# Altium project iMX6 Rex_V1I1.PrjPcb (part 1 of 2)
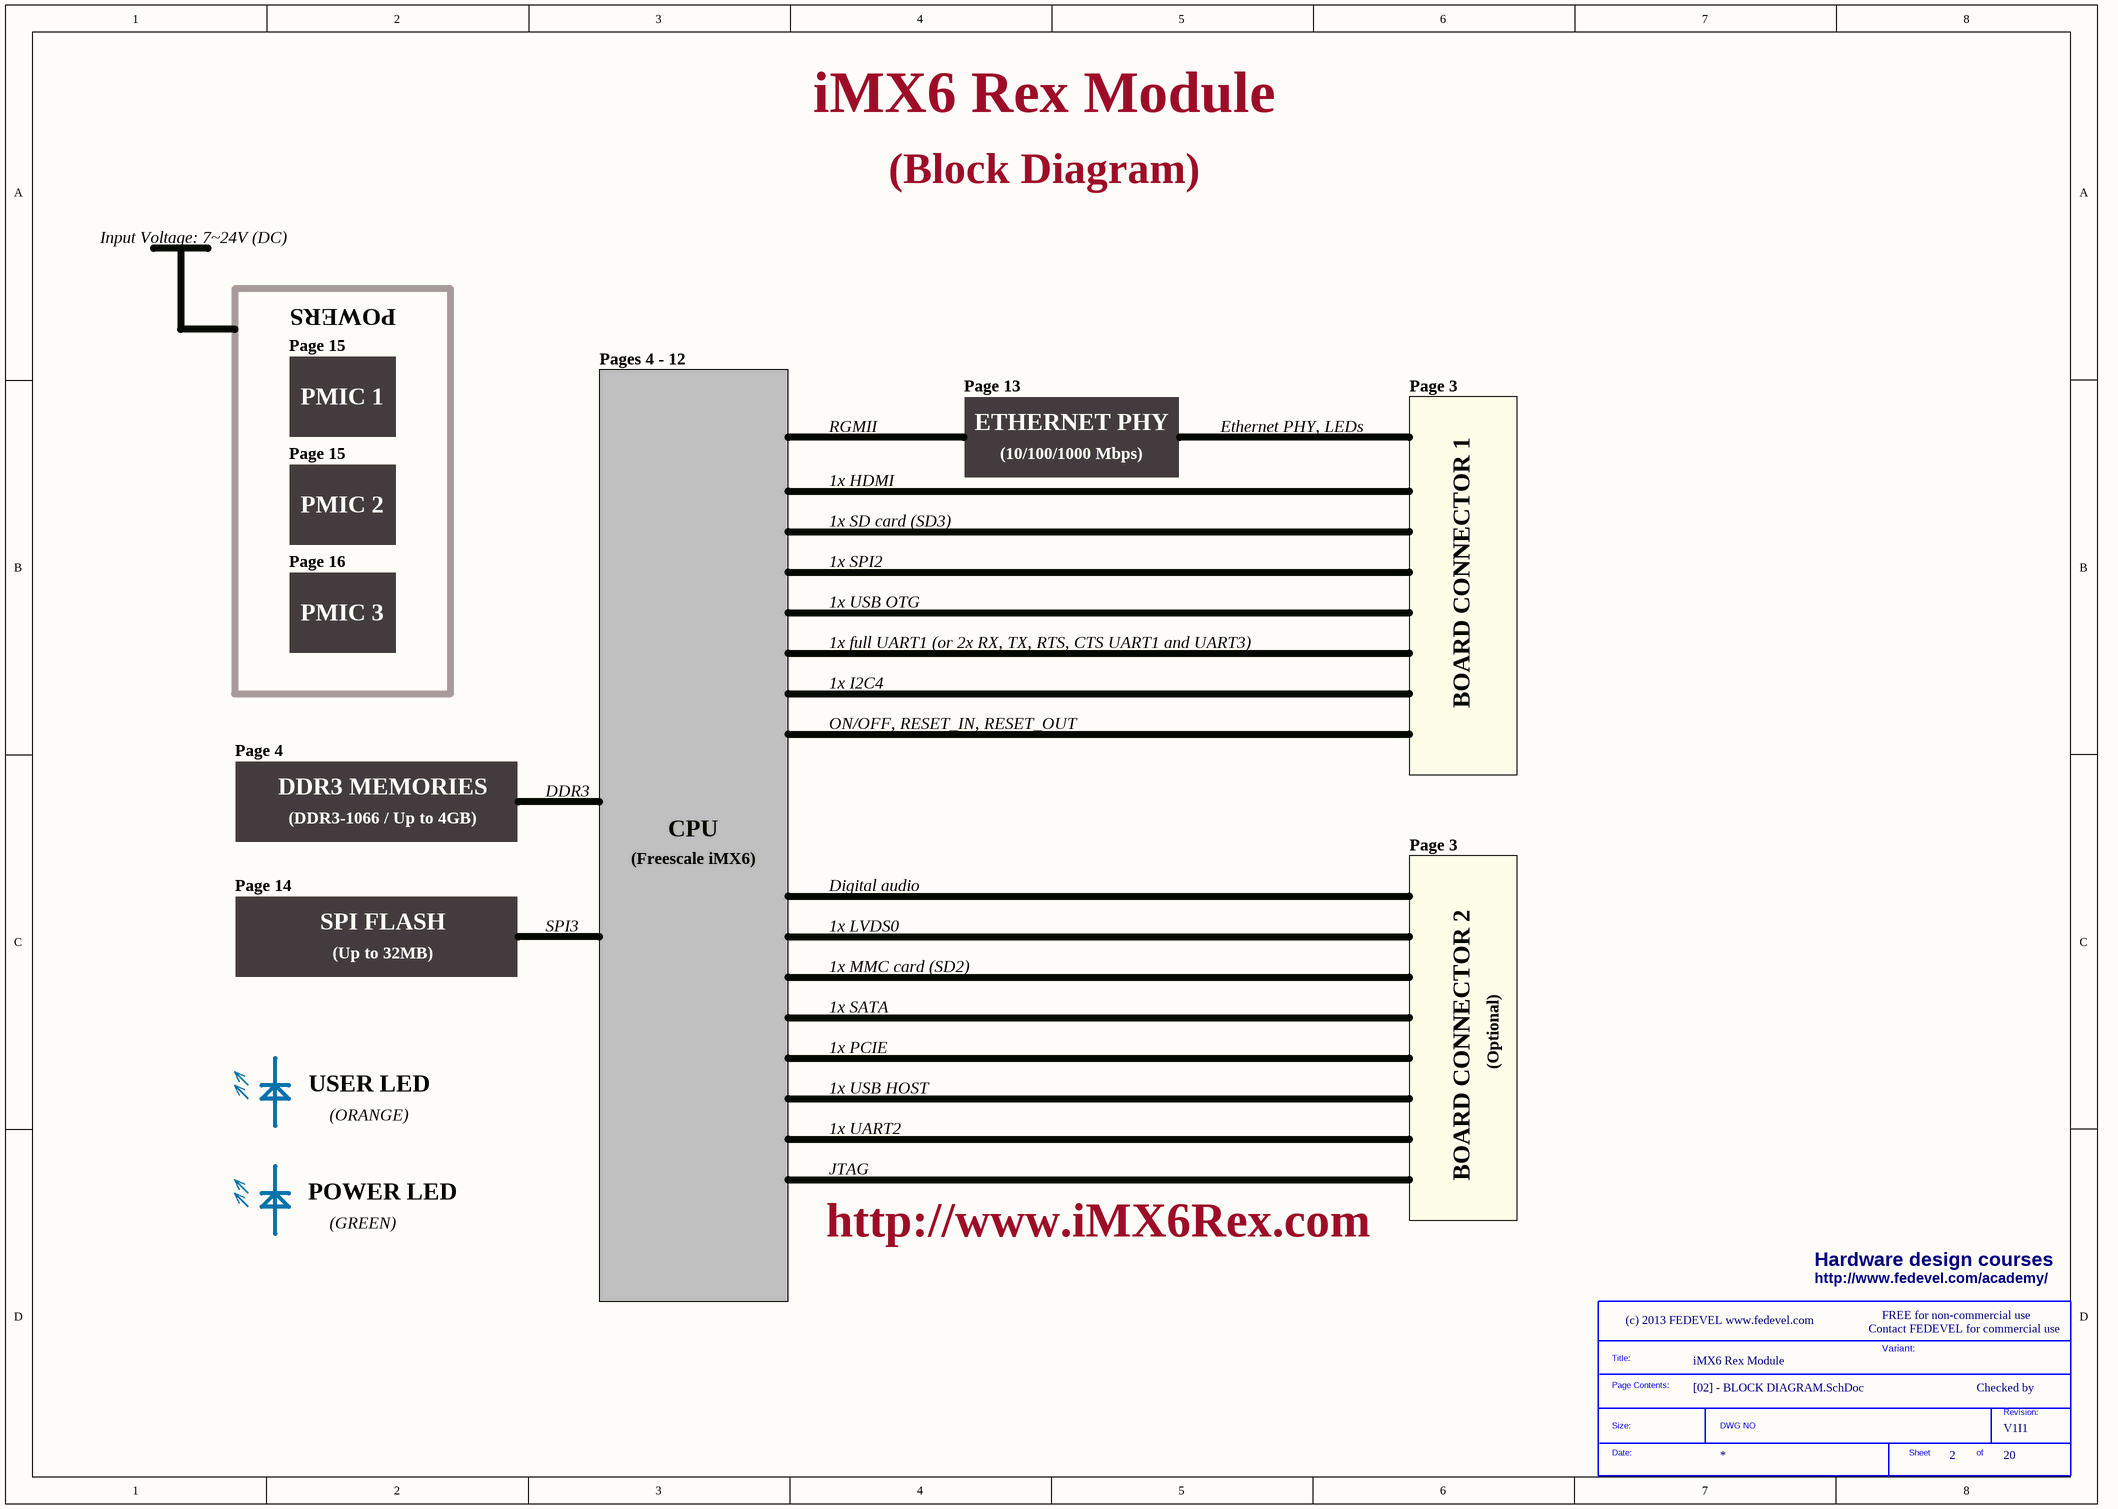
[diagram p0: [02] - BLOCK DIAGRAM.SchDoc]
ClientCompanyName: FEDEVEL Academy; ClientContactEmail: robert.feranec@fedevel.com; ClientContactName: Robert Feranec; ClientWebsite: http://www.fedevel.com/academy/; Company: (c) 2013 FEDEVEL www.fedevel.com; Project: iMX6 Rex Module; VersionRevision: V1I1
8 sheets, 185 parts. Net scope: flat (ports and power ports of the same name join across sheets).
Board file: iMX6 Rex_V1I1_PCB.PcbDoc
Sheets:
  [02] - BLOCK DIAGRAM.SchDoc
  [03] - CONNECTORS.SchDoc
  [09] - CPU - UART, AUDIO.SchDoc
  [11] - CPU - POWER.SchDoc
  [12] - CPU - UNUSED.SchDoc
  [13] - ETHERNET PHY.SchDoc
  [17] - MECH.SchDoc
  [18] - POWER SEQUENCING.SchDoc

## Sheet [02] - BLOCK DIAGRAM.SchDoc
size A3; DocumentNumber: 2; SheetNumber: 2; SheetTotal: 20

### Parts
(Parts that share a designator on the sheet are numbered #1, #2 ... from top to bottom, then left to right.)
*#1  SDTitleBlock  (value not drawn)  (graphical)

### Notes on the sheet
- Input Voltage: 7~24V (DC)
- (Block Diagram)
- POWERS
- Page 15
- Pages 4 - 12
- PMIC 1
- RGMII
- Page 13
- ETHERNET PHY
- Ethernet PHY, LEDs
- Page 3
- PMIC 2
- 1x HDMI
- (10/100/1000 Mbps)
- Page 16
- 1x SD card (SD3)
- 1x SPI2
- BOARD CONNECTOR 1
- PMIC 3
- 1x USB OTG
- 1x full UART1 (or 2x RX, TX, RTS, CTS UART1 and UART3)
- 1x I2C4
- Page 4
- ON/OFF, RESET_IN, RESET_OUT
- DDR3 MEMORIES
- (DDR3-1066 / Up to 4GB)
- DDR3
- CPU
- Page 14
- (Freescale iMX6)
- Digital audio
- SPI FLASH
- (Up to 32MB)
- SPI3
- 1x LVDS0
- 1x MMC card (SD2)
- 1x SATA
- 1x PCIE
- BOARD CONNECTOR 2
- (Optional)
- (ORANGE)
- USER LED
- 1x USB HOST
- 1x UART2
- JTAG
- (GREEN)
- POWER LED
- http://www.iMX6Rex.com
- Hardware design courses
- http://www.fedevel.com/academy/
- Contact FEDEVEL for commercial use
- FREE for non-commercial use
- Variant:
- Checked by
- (in symbol SDTitleBlock) Title:; Page Contents:; Revision:; Size:; DWG NO; Date:; Sheet; of

## Sheet [03] - CONNECTORS.SchDoc
size A2; DocumentNumber: 3; SheetNumber: 3; SheetTotal: 20
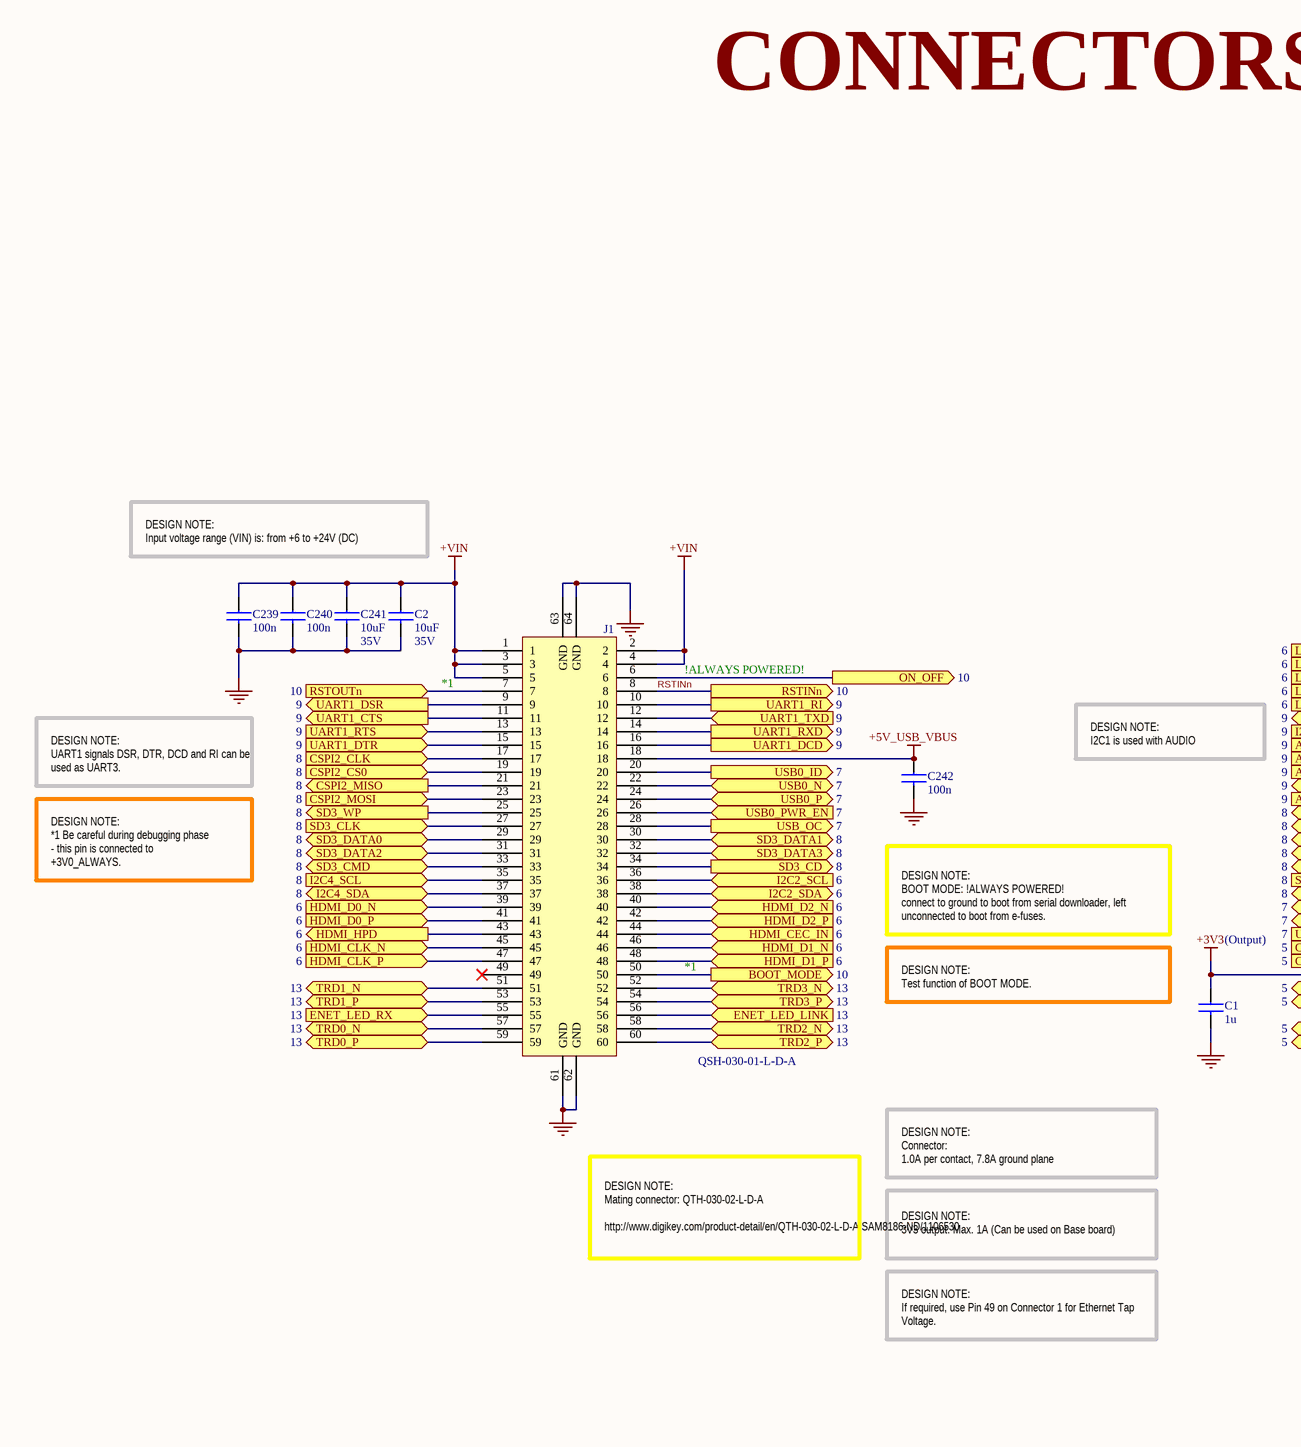
[diagram p1: [03] - CONNECTORS.SchDoc, left]
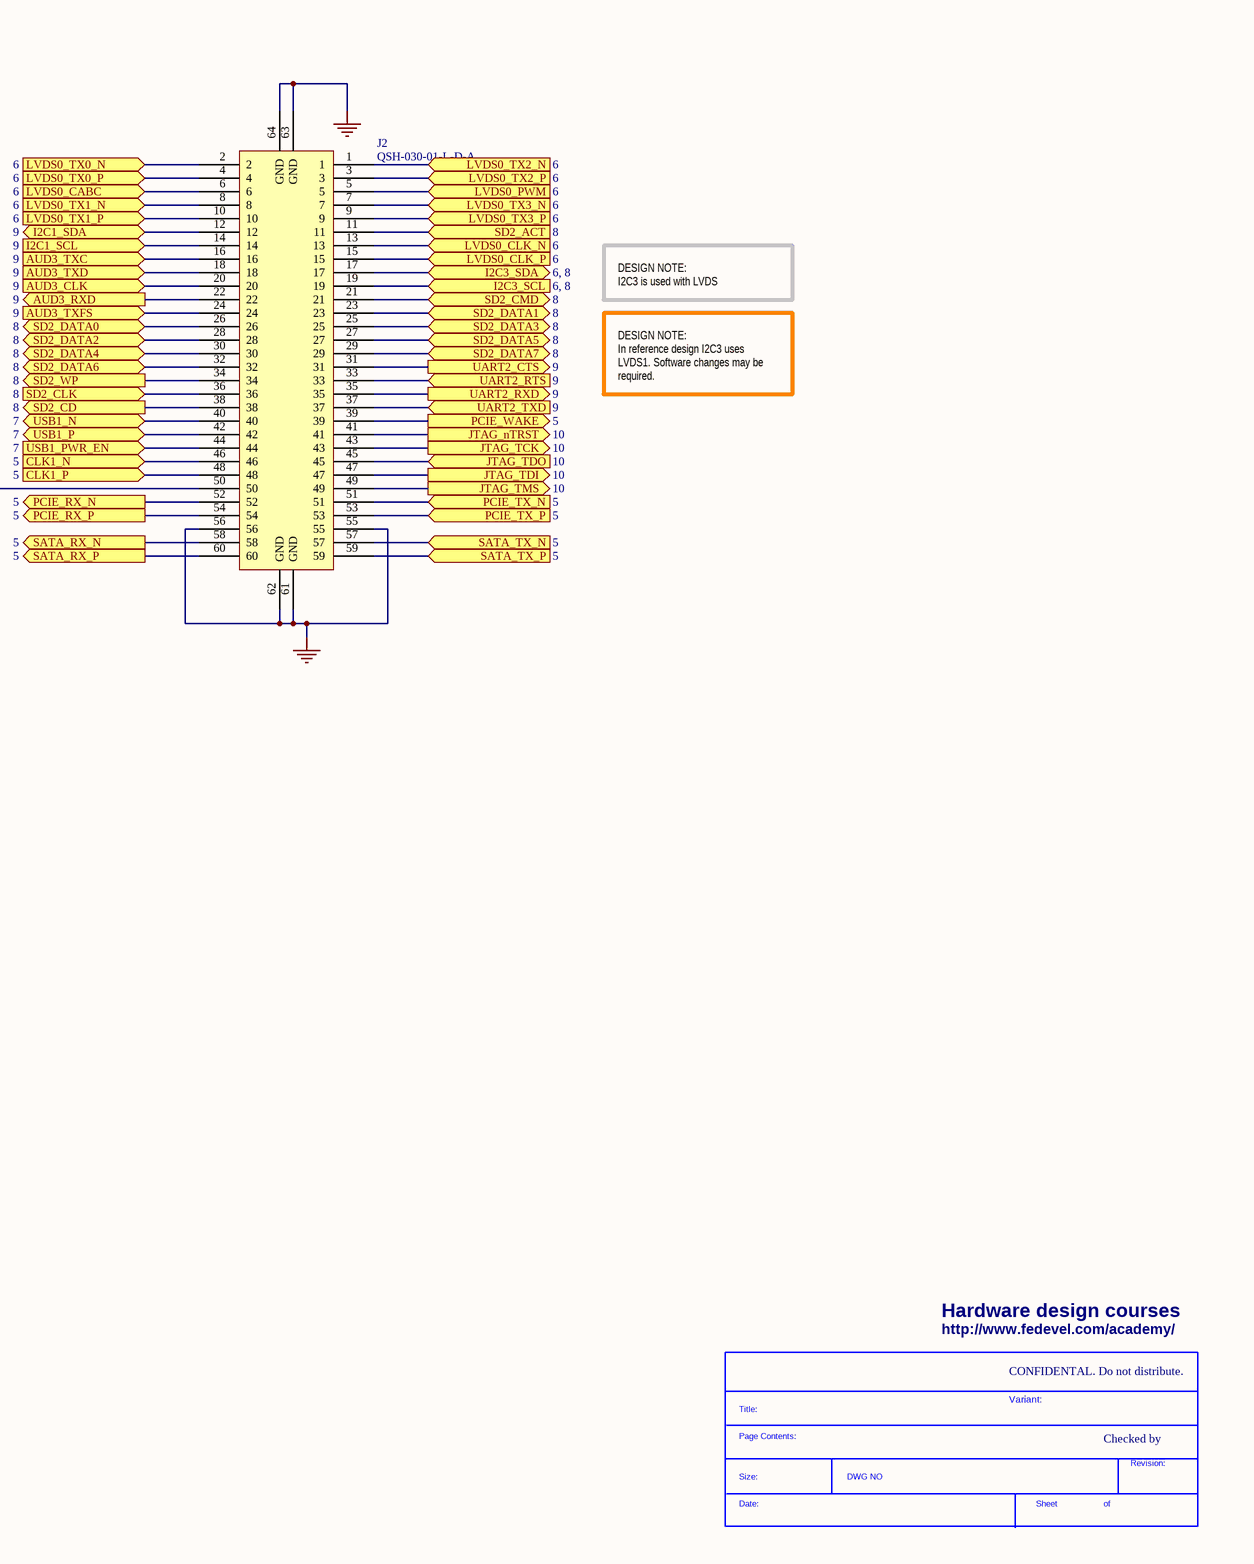
[diagram p2: [03] - CONNECTORS.SchDoc, right]

### Parts
(Parts that share a designator on the sheet are numbered #1, #2 ... from top to bottom, then left to right.)
*#2  SDTitleBlock  (value not drawn)  (graphical)
C1  1u  [C0402]
C2  10uF  Voltage - Rated: 35V  [C1206]
C239  100n  [C0402]
C240  100n  [C0402]
C241  10uF  Voltage - Rated: 35V  [C1206]
C242  100n  [C0402]
J1  QSH-030-01-L-D-A  [QSH-030-01-L-D-A]
J2  QSH-030-01-L-D-A  [QSH-030-01-L-D-A]

### Ports
AUD3_CLK (in, see 9), AUD3_RXD (out, see 9), AUD3_TXC (in, see 9), AUD3_TXD (in, see 9), AUD3_TXFS (in, see 9), BOOT_MODE (out, see 10), CLK1_N (in, see 5), CLK1_P (in, see 5), CSPI2_CLK (in, see 8), CSPI2_CS0 (in, see 8), CSPI2_MISO (out, see 8), CSPI2_MOSI (in, see 8), ENET_LED_LINK (in, see 13), ENET_LED_RX (in, see 13), HDMI_CEC_IN (in, see 6), HDMI_CLK_N (in, see 6), HDMI_CLK_P (in, see 6), HDMI_D0_N (in, see 6), HDMI_D0_P (in, see 6), HDMI_D1_N (in, see 6), HDMI_D1_P (in, see 6), HDMI_D2_N (in, see 6), HDMI_D2_P (in, see 6), HDMI_HPD (out, see 6), I2C1_SCL (in, see 9), I2C1_SDA (bidir, see 9), I2C2_SCL (in, see 6), I2C2_SDA (bidir, see 6), I2C3_SCL (see 6, 8), I2C3_SDA (bidir, see 6, 8), I2C4_SCL (in, see 8), I2C4_SDA (bidir, see 8), JTAG_nTRST (out, see 10), JTAG_TCK (out, see 10), JTAG_TDI (out, see 10), JTAG_TDO (in, see 10), JTAG_TMS (out, see 10), LVDS0_CABC (in, see 6), LVDS0_CLK_N (in, see 6), LVDS0_CLK_P (in, see 6), LVDS0_PWM (in, see 6), LVDS0_TX0_N (in, see 6), LVDS0_TX0_P (in, see 6), LVDS0_TX1_N (in, see 6), LVDS0_TX1_P (in, see 6), LVDS0_TX2_N (in, see 6), LVDS0_TX2_P (in, see 6), LVDS0_TX3_N (in, see 6), LVDS0_TX3_P (in, see 6), ON_OFF (see 10), PCIE_RX_N (out, see 5), PCIE_RX_P (out, see 5), PCIE_TX_N (in, see 5), PCIE_TX_P (in, see 5), PCIE_WAKE (out, see 5), RSTINn (out, see 10), RSTOUTn (see 10), SATA_RX_N (out, see 5), SATA_RX_P (out, see 5), SATA_TX_N (in, see 5), SATA_TX_P (in, see 5), SD2_ACT (in, see 8), SD2_CD (out, see 8), SD2_CLK (in, see 8), SD2_CMD (bidir, see 8), SD2_DATA0 (bidir, see 8), SD2_DATA1 (bidir, see 8), SD2_DATA2 (bidir, see 8), SD2_DATA3 (bidir, see 8), SD2_DATA4 (bidir, see 8), SD2_DATA5 (bidir, see 8), SD2_DATA6 (bidir, see 8), SD2_DATA7 (bidir, see 8), SD2_WP (out, see 8), SD3_CD (out, see 8), SD3_CLK (in, see 8), SD3_CMD (bidir, see 8), SD3_DATA0 (bidir, see 8), SD3_DATA1 (bidir, see 8), SD3_DATA2 (bidir, see 8), SD3_DATA3 (bidir, see 8), SD3_WP (out, see 8), TRD0_N (bidir, see 13), TRD0_P (bidir, see 13), TRD1_N (bidir, see 13), TRD1_P (bidir, see 13), TRD2_N (bidir, see 13), TRD2_P (bidir, see 13), TRD3_N (bidir, see 13), TRD3_P (bidir, see 13), UART1_CTS (out, see 9), UART1_DCD (out, see 9), UART1_DSR (out, see 9), UART1_DTR (in, see 9), UART1_RI (out, see 9), UART1_RTS (in, see 9), UART1_RXD (out, see 9), UART1_TXD (in, see 9), UART2_CTS (out, see 9), UART2_RTS (in, see 9), UART2_RXD (out, see 9), UART2_TXD (in, see 9), USB0_ID (out, see 7), USB0_N (bidir, see 7), USB0_P (bidir, see 7), USB0_PWR_EN (in, see 7), USB1_N (bidir, see 7), USB1_P (bidir, see 7), USB1_PWR_EN (in, see 7), USB_OC (out, see 7)

### Nets
+3V3: C1.1 J2.50
+5V_USB_VBUS: C242.1 J1.18
+VIN: C2.1 C239.1 C240.1 C241.1 J1.1 J1.2 J1.3 J1.4 J1.5
GND: C1.2 C2.2 C239.2 C240.2 C241.2 C242.2 J1.61(GND) J1.62(GND) J1.63(GND) J1.64(GND) J2.55 J2.56 J2.61(GND) J2.62(GND) J2.63(GND) J2.64(GND)
AUD3_CLK: J2.20 ; port AUD3_CLK
AUD3_RXD: J2.22 ; port AUD3_RXD
AUD3_TXC: J2.16 ; port AUD3_TXC
AUD3_TXD: J2.18 ; port AUD3_TXD
AUD3_TXFS: J2.24 ; port AUD3_TXFS
BOOT_MODE: J1.50 ; port BOOT_MODE
CLK1_N: J2.46 ; port CLK1_N
CLK1_P: J2.48 ; port CLK1_P
CSPI2_CLK: J1.17 ; port CSPI2_CLK
CSPI2_CS0: J1.19 ; port CSPI2_CS0
CSPI2_MISO: J1.21 ; port CSPI2_MISO
CSPI2_MOSI: J1.23 ; port CSPI2_MOSI
ENET_LED_LINK: J1.56 ; port ENET_LED_LINK
ENET_LED_RX: J1.55 ; port ENET_LED_RX
HDMI_CEC_IN: J1.44 ; port HDMI_CEC_IN
HDMI_CLK_N: J1.45 ; port HDMI_CLK_N
HDMI_CLK_P: J1.47 ; port HDMI_CLK_P
HDMI_D0_N: J1.39 ; port HDMI_D0_N
HDMI_D0_P: J1.41 ; port HDMI_D0_P
HDMI_D1_N: J1.46 ; port HDMI_D1_N
HDMI_D1_P: J1.48 ; port HDMI_D1_P
HDMI_D2_N: J1.40 ; port HDMI_D2_N
HDMI_D2_P: J1.42 ; port HDMI_D2_P
HDMI_HPD: J1.43 ; port HDMI_HPD
I2C1_SCL: J2.14 ; port I2C1_SCL
I2C1_SDA: J2.12 ; port I2C1_SDA
I2C2_SCL: J1.36 ; port I2C2_SCL
I2C2_SDA: J1.38 ; port I2C2_SDA
I2C3_SCL: J2.19 ; port I2C3_SCL
I2C3_SDA: J2.17 ; port I2C3_SDA
I2C4_SCL: J1.35 ; port I2C4_SCL
I2C4_SDA: J1.37 ; port I2C4_SDA
JTAG_nTRST: J2.41 ; port JTAG_nTRST
JTAG_TCK: J2.43 ; port JTAG_TCK
JTAG_TDI: J2.47 ; port JTAG_TDI
JTAG_TDO: J2.45 ; port JTAG_TDO
JTAG_TMS: J2.49 ; port JTAG_TMS
LVDS0_CABC: J2.6 ; port LVDS0_CABC
LVDS0_CLK_N: J2.13 ; port LVDS0_CLK_N
LVDS0_CLK_P: J2.15 ; port LVDS0_CLK_P
LVDS0_PWM: J2.5 ; port LVDS0_PWM
LVDS0_TX0_N: J2.2 ; port LVDS0_TX0_N
LVDS0_TX0_P: J2.4 ; port LVDS0_TX0_P
LVDS0_TX1_N: J2.8 ; port LVDS0_TX1_N
LVDS0_TX1_P: J2.10 ; port LVDS0_TX1_P
LVDS0_TX2_N: J2.1 ; port LVDS0_TX2_N
LVDS0_TX2_P: J2.3 ; port LVDS0_TX2_P
LVDS0_TX3_N: J2.7 ; port LVDS0_TX3_N
LVDS0_TX3_P: J2.9 ; port LVDS0_TX3_P
ON_OFF: J1.6 ; port ON_OFF
PCIE_RX_N: J2.52 ; port PCIE_RX_N
PCIE_RX_P: J2.54 ; port PCIE_RX_P
PCIE_TX_N: J2.51 ; port PCIE_TX_N
PCIE_TX_P: J2.53 ; port PCIE_TX_P
PCIE_WAKE: J2.39 ; port PCIE_WAKE
RSTINn: J1.8 ; port RSTINn
RSTOUTn: J1.7 ; port RSTOUTn
SATA_RX_N: J2.58 ; port SATA_RX_N
SATA_RX_P: J2.60 ; port SATA_RX_P
SATA_TX_N: J2.57 ; port SATA_TX_N
SATA_TX_P: J2.59 ; port SATA_TX_P
SD2_ACT: J2.11 ; port SD2_ACT
SD2_CD: J2.38 ; port SD2_CD
SD2_CLK: J2.36 ; port SD2_CLK
SD2_CMD: J2.21 ; port SD2_CMD
SD2_DATA0: J2.26 ; port SD2_DATA0
SD2_DATA1: J2.23 ; port SD2_DATA1
SD2_DATA2: J2.28 ; port SD2_DATA2
SD2_DATA3: J2.25 ; port SD2_DATA3
SD2_DATA4: J2.30 ; port SD2_DATA4
SD2_DATA5: J2.27 ; port SD2_DATA5
SD2_DATA6: J2.32 ; port SD2_DATA6
SD2_DATA7: J2.29 ; port SD2_DATA7
SD2_WP: J2.34 ; port SD2_WP
SD3_CD: J1.34 ; port SD3_CD
SD3_CLK: J1.27 ; port SD3_CLK
SD3_CMD: J1.33 ; port SD3_CMD
SD3_DATA0: J1.29 ; port SD3_DATA0
SD3_DATA1: J1.30 ; port SD3_DATA1
SD3_DATA2: J1.31 ; port SD3_DATA2
SD3_DATA3: J1.32 ; port SD3_DATA3
SD3_WP: J1.25 ; port SD3_WP
TRD0_N: J1.57 ; port TRD0_N
TRD0_P: J1.59 ; port TRD0_P
TRD1_N: J1.51 ; port TRD1_N
TRD1_P: J1.53 ; port TRD1_P
TRD2_N: J1.58 ; port TRD2_N
TRD2_P: J1.60 ; port TRD2_P
TRD3_N: J1.52 ; port TRD3_N
TRD3_P: J1.54 ; port TRD3_P
UART1_CTS: J1.11 ; port UART1_CTS
UART1_DCD: J1.16 ; port UART1_DCD
UART1_DSR: J1.9 ; port UART1_DSR
UART1_DTR: J1.15 ; port UART1_DTR
UART1_RI: J1.10 ; port UART1_RI
UART1_RTS: J1.13 ; port UART1_RTS
UART1_RXD: J1.14 ; port UART1_RXD
UART1_TXD: J1.12 ; port UART1_TXD
UART2_CTS: J2.31 ; port UART2_CTS
UART2_RTS: J2.33 ; port UART2_RTS
UART2_RXD: J2.35 ; port UART2_RXD
UART2_TXD: J2.37 ; port UART2_TXD
USB0_ID: J1.20 ; port USB0_ID
USB0_N: J1.22 ; port USB0_N
USB0_P: J1.24 ; port USB0_P
USB0_PWR_EN: J1.26 ; port USB0_PWR_EN
USB1_N: J2.40 ; port USB1_N
USB1_P: J2.42 ; port USB1_P
USB1_PWR_EN: J2.44 ; port USB1_PWR_EN
USB_OC: J1.28 ; port USB_OC

Not connected (* = marked no-connect by the designer): J1 49* 65(HOLE1) 66(HOLE2); J2 65(HOLE1) 66(HOLE2)

### Notes on the sheet
- CONNECTORS
- DESIGN NOTE:
  Input voltage range (VIN) is: from +6 to +24V (DC)
- *1
- !ALWAYS POWERED!
- DESIGN NOTE:
  UART1 signals DSR, DTR, DCD and RI can be used as UART3.
- DESIGN NOTE:
  I2C1 is used with AUDIO
- DESIGN NOTE:
  I2C3 is used with LVDS
- DESIGN NOTE:
  *1 Be careful during debugging phase - this pin is connected to +3V0_ALWAYS.
- DESIGN NOTE:
  In reference design I2C3 uses LVDS1. Software changes may be required.
- DESIGN NOTE:
  BOOT MODE: !ALWAYS POWERED!
  connect to ground to boot from serial downloader, left unconnected to boot from e-fuses.
- (Output)
- DESIGN NOTE:
  Test function of BOOT MODE.
- DESIGN NOTE:
  Connector:
  1.0A per contact, 7.8A ground plane
- DESIGN NOTE:
  Mating connector: QTH-030-02-L-D-A
  http://www.digikey.com/product-detail/en/QTH-030-02-L-D-A/SAM8186-ND/1106530
- DESIGN NOTE:
  3V3 output. Max. 1A (Can be used on Base board)
- DESIGN NOTE:
  If required, use Pin 49 on Connector 1 for Ethernet Tap Voltage.
- Hardware design courses
- http://www.fedevel.com/academy/
- CONFIDENTAL. Do not distribute.
- Variant:
- Checked by
- (in symbol SDTitleBlock) Title:; Page Contents:; Revision:; Size:; DWG NO; Date:; Sheet; of

### Library data of the parts
C1 = C1005X5R1C105K: CAP CER 1.0UF 16V X5R 0402; Manufacturer: TDK Corporation; Capacitance: 1.0µF; Value: 1uF; .Checked PCB: used; Tolerance: ±10%; Category: Capacitors; Manufacturer Part Number: C1005X5R1C105K; Operating Temperature: -55°C ~ 85°C; Package / Case: 0402 (1005 Metric); Price 1k [$]: 0.02080; .Checked SCH: used; Voltage - Rated: 16V; Supplier Part Number: 445-4978-1-ND; Supplier: Digikey; Supplier 1: Digi-Key; Supplier Part Number 1: 445-4978-1-ND; RoHS: RoHS Compliant; Stock 1: 341010; Pricing 1: 1=0.24, 10=0.16, 100=0.064, 250=0.046, 500=0.0328, 1000=0.024 (USD); Temperature Coefficient: X5R; Mounting Type: Surface Mount, MLCC; Applications: General Purpose; Ratings: -; Size / Dimension: 0.039" L x 0.020" W (1.00mm x 0.50mm); Height - Seated (Max): -; Thickness (Max): 0.022" (0.55mm); Lead Spacing: -; Features: -; Packaging: Cut Tape (CT); Lead Style: -; ComponentLink1URL: http://www.tdk.co.jp/tefe02/e412_c.pdf; ComponentLink1Description: http://www.tdk.co.jp/tefe02/e412_c.pdf
C2 C241 = GRM31CR6YA106KA12L: CAP CER 10UF 35V X5R 1206; Manufacturer: Murata Electronics North America; Capacitance: 10µF; .Checked PCB: used; Tolerance: ±10%; Category: Capacitors; Manufacturer Part Number: GRM31CR6YA106KA12L; Operating Temperature: -55°C ~ 85°C; Package / Case: 1206 (3216 Metric); Price 1k [$]: 0.19448; Value: 10uF; .Checked SCH: used; Supplier Part Number: 490-5524-1-ND; Supplier: Digikey; Supplier 1: Digi-Key; Supplier Part Number 1: 490-5524-1-ND; RoHS: RoHS Compliant; Stock 1: 76334; Pricing 1: 1=0.6, 10=0.501, 50=0.359, 100=0.3142, 250=0.24684, 500=0.2244, 1000=0.17952 (USD); Temperature Coefficient: X5R; Mounting Type: Surface Mount, MLCC; Applications: General Purpose; Ratings: -; Size / Dimension: 0.126" L x 0.063" W (3.20mm x 1.60mm); Height - Seated (Max): -; Thickness (Max): 0.071" (1.80mm); Lead Spacing: -; Features: -; Packaging: Cut Tape (CT); Lead Style: -; ComponentLink1URL: http://www.murata.com/products/catalog/pdf/c02e.pdf; ComponentLink1Description: http://www.murata.com/products/catalog/pdf/c02e.pdf
C239 C240 C242 = C1005X5R1H104K: CAP CER .10UF 50V X5R 10% 0402; Manufacturer: TDK Corporation; Capacitance: 0.1µF; Value: 100nF; .Checked PCB: used; Category: Capacitors; Supplier Part Number: 445-5942-1-ND; Manufacturer Part Number: C1005X5R1H104K; Operating Temperature: -55°C ~ 85°C; Package / Case: 0402 (1005 Metric); Price 1k [$]: 0.02340; .Checked SCH: used; Voltage - Rated: 50V; Supplier: Digikey; Supplier 1: Digi-Key; Supplier Part Number 1: 445-5942-1-ND; RoHS: RoHS Compliant; Stock 1: 106926; Pricing 1: 1=0.27, 10=0.18, 100=0.072, 250=0.05176, 500=0.0369, 1000=0.027 (USD); Tolerance: ±10%; Temperature Coefficient: X5R; Mounting Type: Surface Mount, MLCC; Applications: General Purpose; Ratings: -; Size / Dimension: 0.039" L x 0.020" W (1.00mm x 0.50mm); Height - Seated (Max): -; Thickness (Max): 0.022" (0.55mm); Lead Spacing: -; Features: -; Packaging: Cut Tape (CT); Lead Style: -; ComponentLink1URL: http://www.tdk.co.jp/tefe02/e412_c.pdf; ComponentLink1Description: http://www.tdk.co.jp/tefe02/e412_c.pdf
J1 J2 = QSH-030-01-L-D-A: CONN RCPT HI-SPD .5MM 60POS DL; Manufacturer: Samtec Inc; .Checked PCB: used; Connector Type: Receptacle, Center Strip Contacts; Number of Positions: 60; Pitch: 0.020" (0.50mm); Mating connector: QTH-030-02-L-D-A; Mated Stacking Heights: 5mm, 8mm, 11mm, 16mm, 19mm, 25mm; .Checked SCH: used; Category: Connectors, Interconnects; Manufacturer Part Number: QSH-030-01-L-D-A; Price 1k [$]: 5.18075; Value: QSH-030-01-L-D-A; Number of Rows: 2; Height with mainting: 5mm, 8mm, 11mm, 16mm, 19mm, 25mm; Supplier Part Number: SAM8180-ND; Supplier: Digikey; Supplier 1: Digi-Key; Supplier Part Number 1: SAM8180-ND; RoHS: RoHS Compliant; Stock 1: 3746; Pricing 1: 1=8.96, 10=8.288, 25=7.84, 50=7.4368, 100=6.944, 250=6.048, 500=5.824, 1000=5.6, 2500=5.376 (USD); Mounting Type: Surface Mount; Features: Board Guide, Ground Bus (Plane); Contact Finish: Gold; Contact Finish Thickness: 10µin (0.25µm); Packaging: Tray; Height Above Board: 0.128" (3.25mm); ComponentLink1URL: http://www.samtec.com/ftppub/cpdf/QSH-XXX-01-X-D-XX-MKT.pdf; ComponentLink1Description: http://www.samtec.com/ftppub/cpdf/QSH-XXX-01-X-D-XX-MKT.pdf

## Sheet [09] - CPU - UART, AUDIO.SchDoc
size A2; DocumentNumber: 9; SheetNumber: 9; SheetTotal: 20
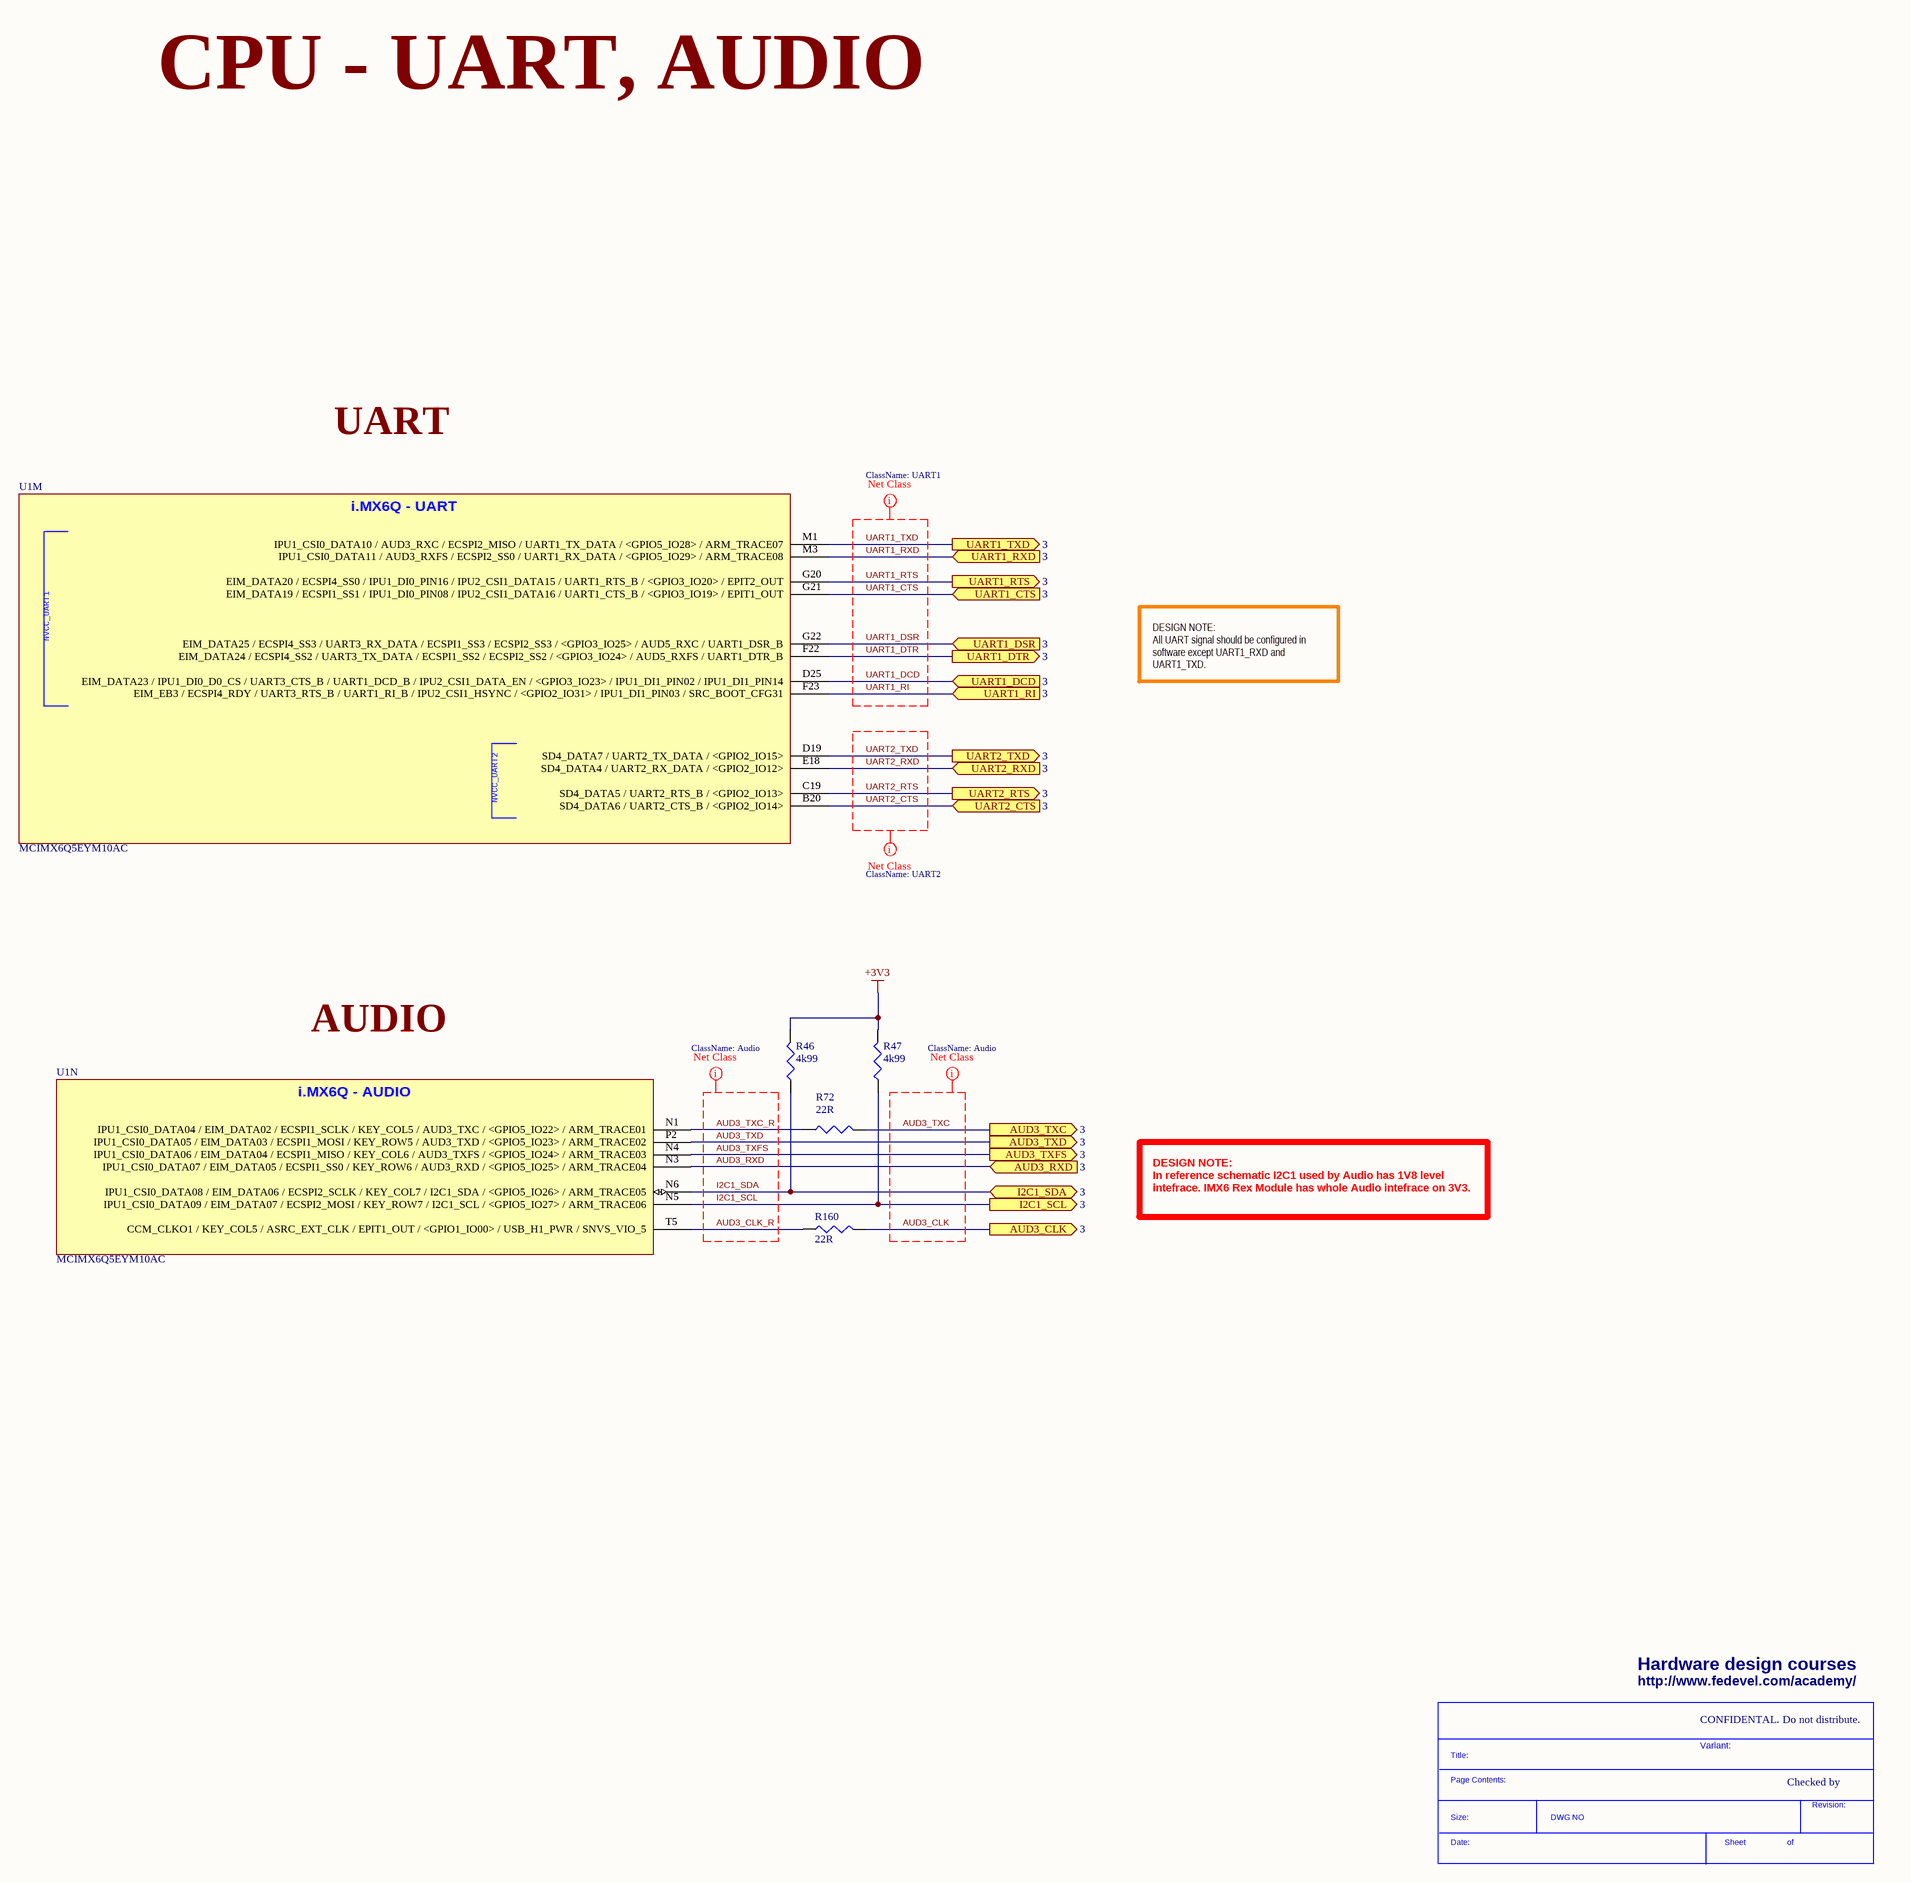
[diagram p3: [09] - CPU - UART, AUDIO.SchDoc]

### Parts
(Parts that share a designator on the sheet are numbered #1, #2 ... from top to bottom, then left to right.)
*#3  SDTitleBlock  (value not drawn)  (graphical)
R46  4k99  [R0402]
R47  4k99  [R0402]
R72  22R  [R0402]
R160  22R  [R0402]
U1  MCIMX6Q5EYM10AC  [PBGA624]  (parts M,N of 15)

### Ports
AUD3_CLK (out, see 3), AUD3_RXD (in, see 3), AUD3_TXC (out, see 3), AUD3_TXD (out, see 3), AUD3_TXFS (out, see 3), I2C1_SCL (out, see 3), I2C1_SDA (bidir, see 3), UART1_CTS (in, see 3), UART1_DCD (in, see 3), UART1_DSR (in, see 3), UART1_DTR (out, see 3), UART1_RI (in, see 3), UART1_RTS (out, see 3), UART1_RXD (in, see 3), UART1_TXD (out, see 3), UART2_CTS (in, see 3), UART2_RTS (out, see 3), UART2_RXD (in, see 3), UART2_TXD (out, see 3)

### Nets
+3V3: R46.2 R47.2
AUD3_CLK: R160.2 ; port AUD3_CLK
AUD3_CLK_R: R160.1 U1.T5(CCM_CLKO1_/_KEY_COL5_/_ASRC_EXT_CLK_/_EPIT1_OUT_/_<GPIO1_IO00>_/_USB_H1_PWR_/_SNVS_VIO_5)
AUD3_RXD: U1.N3(IPU1_CSI0_DATA07_/_EIM_DATA05_/_ECSPI1_SS0_/_KEY_ROW6_/_AUD3_RXD_/_<GPIO5_IO25>_/_ARM_TRACE04) ; port AUD3_RXD
AUD3_TXC: R72.2 ; port AUD3_TXC
AUD3_TXC_R: R72.1 U1.N1(IPU1_CSI0_DATA04_/_EIM_DATA02_/_ECSPI1_SCLK_/_KEY_COL5_/_AUD3_TXC_/_<GPIO5_IO22>_/_ARM_TRACE01)
AUD3_TXD: U1.P2(IPU1_CSI0_DATA05_/_EIM_DATA03_/_ECSPI1_MOSI_/_KEY_ROW5_/_AUD3_TXD_/_<GPIO5_IO23>_/_ARM_TRACE02) ; port AUD3_TXD
AUD3_TXFS: U1.N4(IPU1_CSI0_DATA06_/_EIM_DATA04_/_ECSPI1_MISO_/_KEY_COL6_/_AUD3_TXFS_/_<GPIO5_IO24>_/_ARM_TRACE03) ; port AUD3_TXFS
I2C1_SCL: R47.1 U1.N5(IPU1_CSI0_DATA09_/_EIM_DATA07_/_ECSPI2_MOSI_/_KEY_ROW7_/_I2C1_SCL_/_<GPIO5_IO27>_/_ARM_TRACE06) ; port I2C1_SCL
I2C1_SDA: R46.1 U1.N6(IPU1_CSI0_DATA08_/_EIM_DATA06_/_ECSPI2_SCLK_/_KEY_COL7_/_I2C1_SDA_/_<GPIO5_IO26>_/_ARM_TRACE05) ; port I2C1_SDA
UART1_CTS: U1.G21(EIM_DATA19_/_ECSPI1_SS1_/_IPU1_DI0_PIN08_/_IPU2_CSI1_DATA16_/_UART1_CTS_B_/_<GPIO3_IO19>_/_EPIT1_OUT) ; port UART1_CTS
UART1_DCD: U1.D25(EIM_DATA23_/_IPU1_DI0_D0_CS_/_UART3_CTS_B_/_UART1_DCD_B_/_IPU2_CSI1_DATA_EN_/_<GPIO3_IO23>_/_IPU1_DI1_PIN02_/_IPU1_DI1_PIN14) ; port UART1_DCD
UART1_DSR: U1.G22(EIM_DATA25_/_ECSPI4_SS3_/_UART3_RX_DATA_/_ECSPI1_SS3_/_ECSPI2_SS3_/_<GPIO3_IO25>_/_AUD5_RXC_/_UART1_DSR_B) ; port UART1_DSR
UART1_DTR: U1.F22(EIM_DATA24_/_ECSPI4_SS2_/_UART3_TX_DATA_/_ECSPI1_SS2_/_ECSPI2_SS2_/_<GPIO3_IO24>_/_AUD5_RXFS_/_UART1_DTR_B) ; port UART1_DTR
UART1_RI: U1.F23(EIM_EB3_/_ECSPI4_RDY_/_UART3_RTS_B_/_UART1_RI_B_/_IPU2_CSI1_HSYNC_/_<GPIO2_IO31>_/_IPU1_DI1_PIN03_/_SRC_BOOT_CFG31) ; port UART1_RI
UART1_RTS: U1.G20(EIM_DATA20_/_ECSPI4_SS0_/_IPU1_DI0_PIN16_/_IPU2_CSI1_DATA15_/_UART1_RTS_B_/_<GPIO3_IO20>_/_EPIT2_OUT) ; port UART1_RTS
UART1_RXD: U1.M3(IPU1_CSI0_DATA11_/_AUD3_RXFS_/_ECSPI2_SS0_/_UART1_RX_DATA_/_<GPIO5_IO29>_/_ARM_TRACE08) ; port UART1_RXD
UART1_TXD: U1.M1(IPU1_CSI0_DATA10_/_AUD3_RXC_/_ECSPI2_MISO_/_UART1_TX_DATA_/_<GPIO5_IO28>_/_ARM_TRACE07) ; port UART1_TXD
UART2_CTS: U1.B20(SD4_DATA6_/_UART2_CTS_B_/_<GPIO2_IO14>) ; port UART2_CTS
UART2_RTS: U1.C19(SD4_DATA5_/_UART2_RTS_B_/_<GPIO2_IO13>) ; port UART2_RTS
UART2_RXD: U1.E18(SD4_DATA4_/_UART2_RX_DATA_/_<GPIO2_IO12>) ; port UART2_RXD
UART2_TXD: U1.D19(SD4_DATA7_/_UART2_TX_DATA_/_<GPIO2_IO15>) ; port UART2_TXD

### Layout directives
net class UART1: UART1_CTS, UART1_DCD, UART1_DSR, UART1_DTR, UART1_RI, UART1_RTS, UART1_RXD, UART1_TXD
net class UART2: UART2_CTS, UART2_RTS, UART2_RXD, UART2_TXD
net class Audio: AUD3_CLK, AUD3_CLK_R, AUD3_RXD, AUD3_TXC, AUD3_TXC_R, AUD3_TXD, AUD3_TXFS, I2C1_SCL, I2C1_SDA

### Notes on the sheet
- CPU - UART, AUDIO
- UART
- DESIGN NOTE:
  All UART signal should be configured in software except UART1_RXD and UART1_TXD.
- AUDIO
- DESIGN NOTE:
  In reference schematic I2C1 used by Audio has 1V8 level intefrace. IMX6 Rex Module has whole Audio intefrace on 3V3.
- Hardware design courses
- http://www.fedevel.com/academy/
- CONFIDENTAL. Do not distribute.
- Variant:
- Checked by
- (in symbol MCIMX6Q5EYM10AC, part M) i.MX6Q - UART; NVCC_UART1; NVCC_UART2
- (in symbol MCIMX6Q5EYM10AC, part N) i.MX6Q - AUDIO
- (in symbol SDTitleBlock) Title:; Page Contents:; Revision:; Size:; DWG NO; Date:; Sheet; of

### Library data of the parts
R46 R47 = RMCF0402FT4K99: RES TF 4.99K OHM 1% 1/16W 0402; Manufacturer: Stackpole Electronics Inc; Power (Watts): 0.063W, 1/16W; .Checked PCB: used; Temperature Coefficient: ±100ppm/°C; Category: Resistors; Supplier Part Number: RMCF0402FT4K99CT-ND; Manufacturer Part Number: RMCF0402FT4K99; Package / Case: 0402 (1005 Metric); Price 1k [$]: 0.00384; Resistance (Ohms): 4.99K; Tolerance: ±1%; Value: 4k99; .Checked SCH: used; Supplier: Digikey; Supplier 1: Digi-Key; Supplier Part Number 1: RMCF0402FT4K99CT-ND; RoHS: RoHS Compliant; Stock 1: 48509; Pricing 1: 1=0.04, 10=0.025, 50=0.0138, 100=0.0105, 250=0.0078, 500=0.00576, 1000=0.00384 (USD); Composition: Thick Film; Features: -; Size / Dimension: 0.039" L x 0.020" W (1.00mm x 0.50mm); Height: 0.016" (0.40mm); Number of Terminations: 2; Packaging: Cut Tape (CT); ComponentLink1URL: http://www.seielect.com/Catalog/SEI-RMCF.pdf; ComponentLink1Description: http://www.seielect.com/Catalog/SEI-RMCF.pdf
R72 R160 = RC0402FR-0722RL: RES 22.0 OHM 1/16W 1% 0402 SMD; Manufacturer: Yageo; Resistance (Ohms): 22; Power (Watts): 0.063W, 1/16W; .Checked PCB: used; Temperature Coefficient: ±100ppm/°C; Category: Resistors; Supplier Part Number: 311-22.0LRCT-ND; Manufacturer Part Number: RC0402FR-0722RL; Package / Case: 0402 (1005 Metric); Price 1k [$]: 0.01421; Tolerance: ±1%; Value: 22R; .Checked SCH: used; Supplier: Digikey; Supplier 1: Digi-Key; Supplier Part Number 1: 311-22.0LRCT-ND; RoHS: RoHS Compliant; Stock 1: 943800; Pricing 1: 10=0.014, 50=0.0104, 100=0.0079, 250=0.00584, 500=0.00432, 1000=0.00288 (USD); Composition: Thick Film; Features: -; Size / Dimension: 0.039" L x 0.020" W (1.00mm x 0.50mm); Height: 0.016" (0.40mm); Number of Terminations: 2; Packaging: Cut Tape (CT); ComponentLink1URL: http://www.yageo.com/documents/recent/PYu-RC0402_51_RoHS_L_6.pdf; ComponentLink1Description: http://www.yageo.com/documents/recent/PYu-RC0402_51_RoHS_L_6.pdf
U1 = MCIMX6Q5EYM10AC: IC MCU 32BIT ARM QUAD 624FCBGA; Manufacturer: Freescale Semiconductor; Core Processor: ARM® Cortex™-A9; Core Size: 32-Bit Quad-Core; Speed: 1.0GHz; Connectivity: CAN, EBI/EMI, ESAI, Ethernet, GPMI, I2C, MMC/SD, PCI, SATA, SPI, UART, USB, USB OTG; Peripherals: DMA, HDMI, I2S/SSI/AC97, MIPI CSI, MIMI DSI, MIPI HIS, PWM, WDT; Number of I /O: 224; Program Memory Type: External Program Memory; RAM Size: 256K x 8; Voltage - Supply (Vcc/Vdd): 0.925 V ~ 1.5 V; Oscillator Type: Internal; .Creator: MM; .Checked PCB: MM, checked by RF; Supplier 1: Digi-Key; Manufacturer Part Number: MCIMX6Q5EYM10AC; RoHS: RoHS Compliant; Category: Integrated Circuits (ICs); Stock 1: 0; Pricing 1: 1=54.98, 10=51.922, 25=48.868, 100=30.5424 (USD); Program Memory Size: -; EEPROM Size: -; Data Converters: -; Operating Temperature: -20°C ~ 105°C; Package / Case: 624-FBGA, FCBGA; Packaging: Tray; ComponentLink1URL: http://cache.freescale.com/files/32bit/doc/data_sheet/IMX6DQCEC.pdf; ComponentLink1Description: http://cache.freescale.com/files/32bit/doc/data_sheet/IMX6DQCEC.pdf; Supplier Part Number 1: MCIMX6Q5EYM10AC-ND; .Checked SCH: MM

## Sheet [11] - CPU - POWER.SchDoc
size A2; DocumentNumber: 11; SheetNumber: 11; SheetTotal: 20
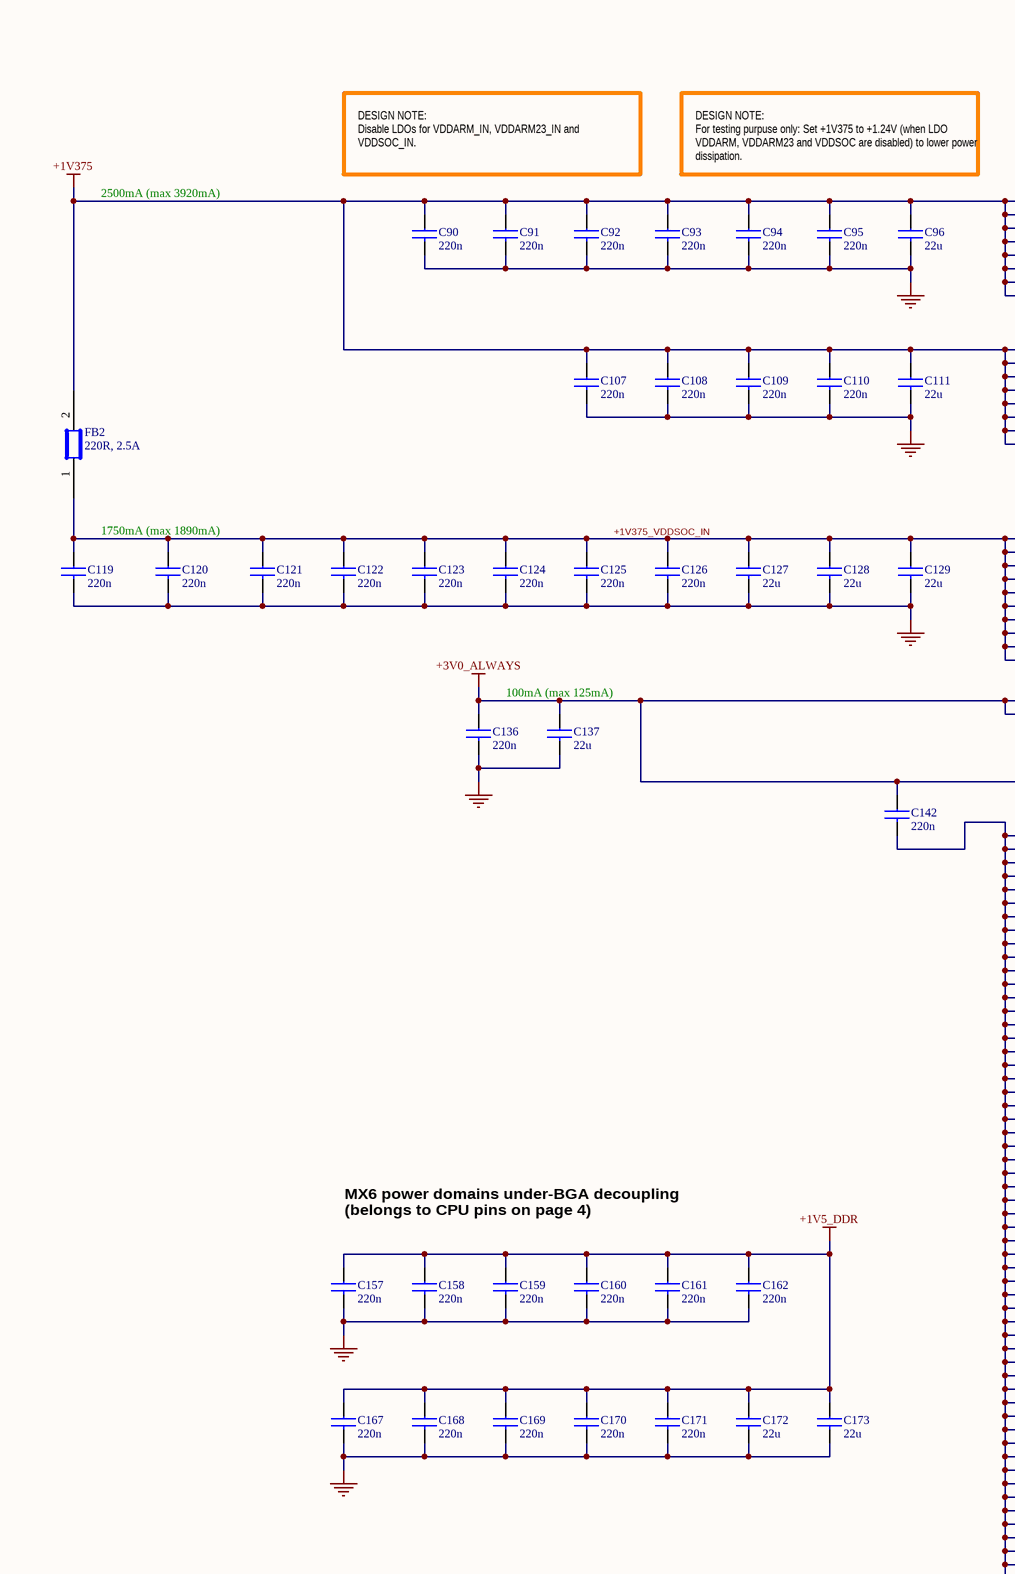
[diagram p4: [11] - CPU - POWER.SchDoc, left]
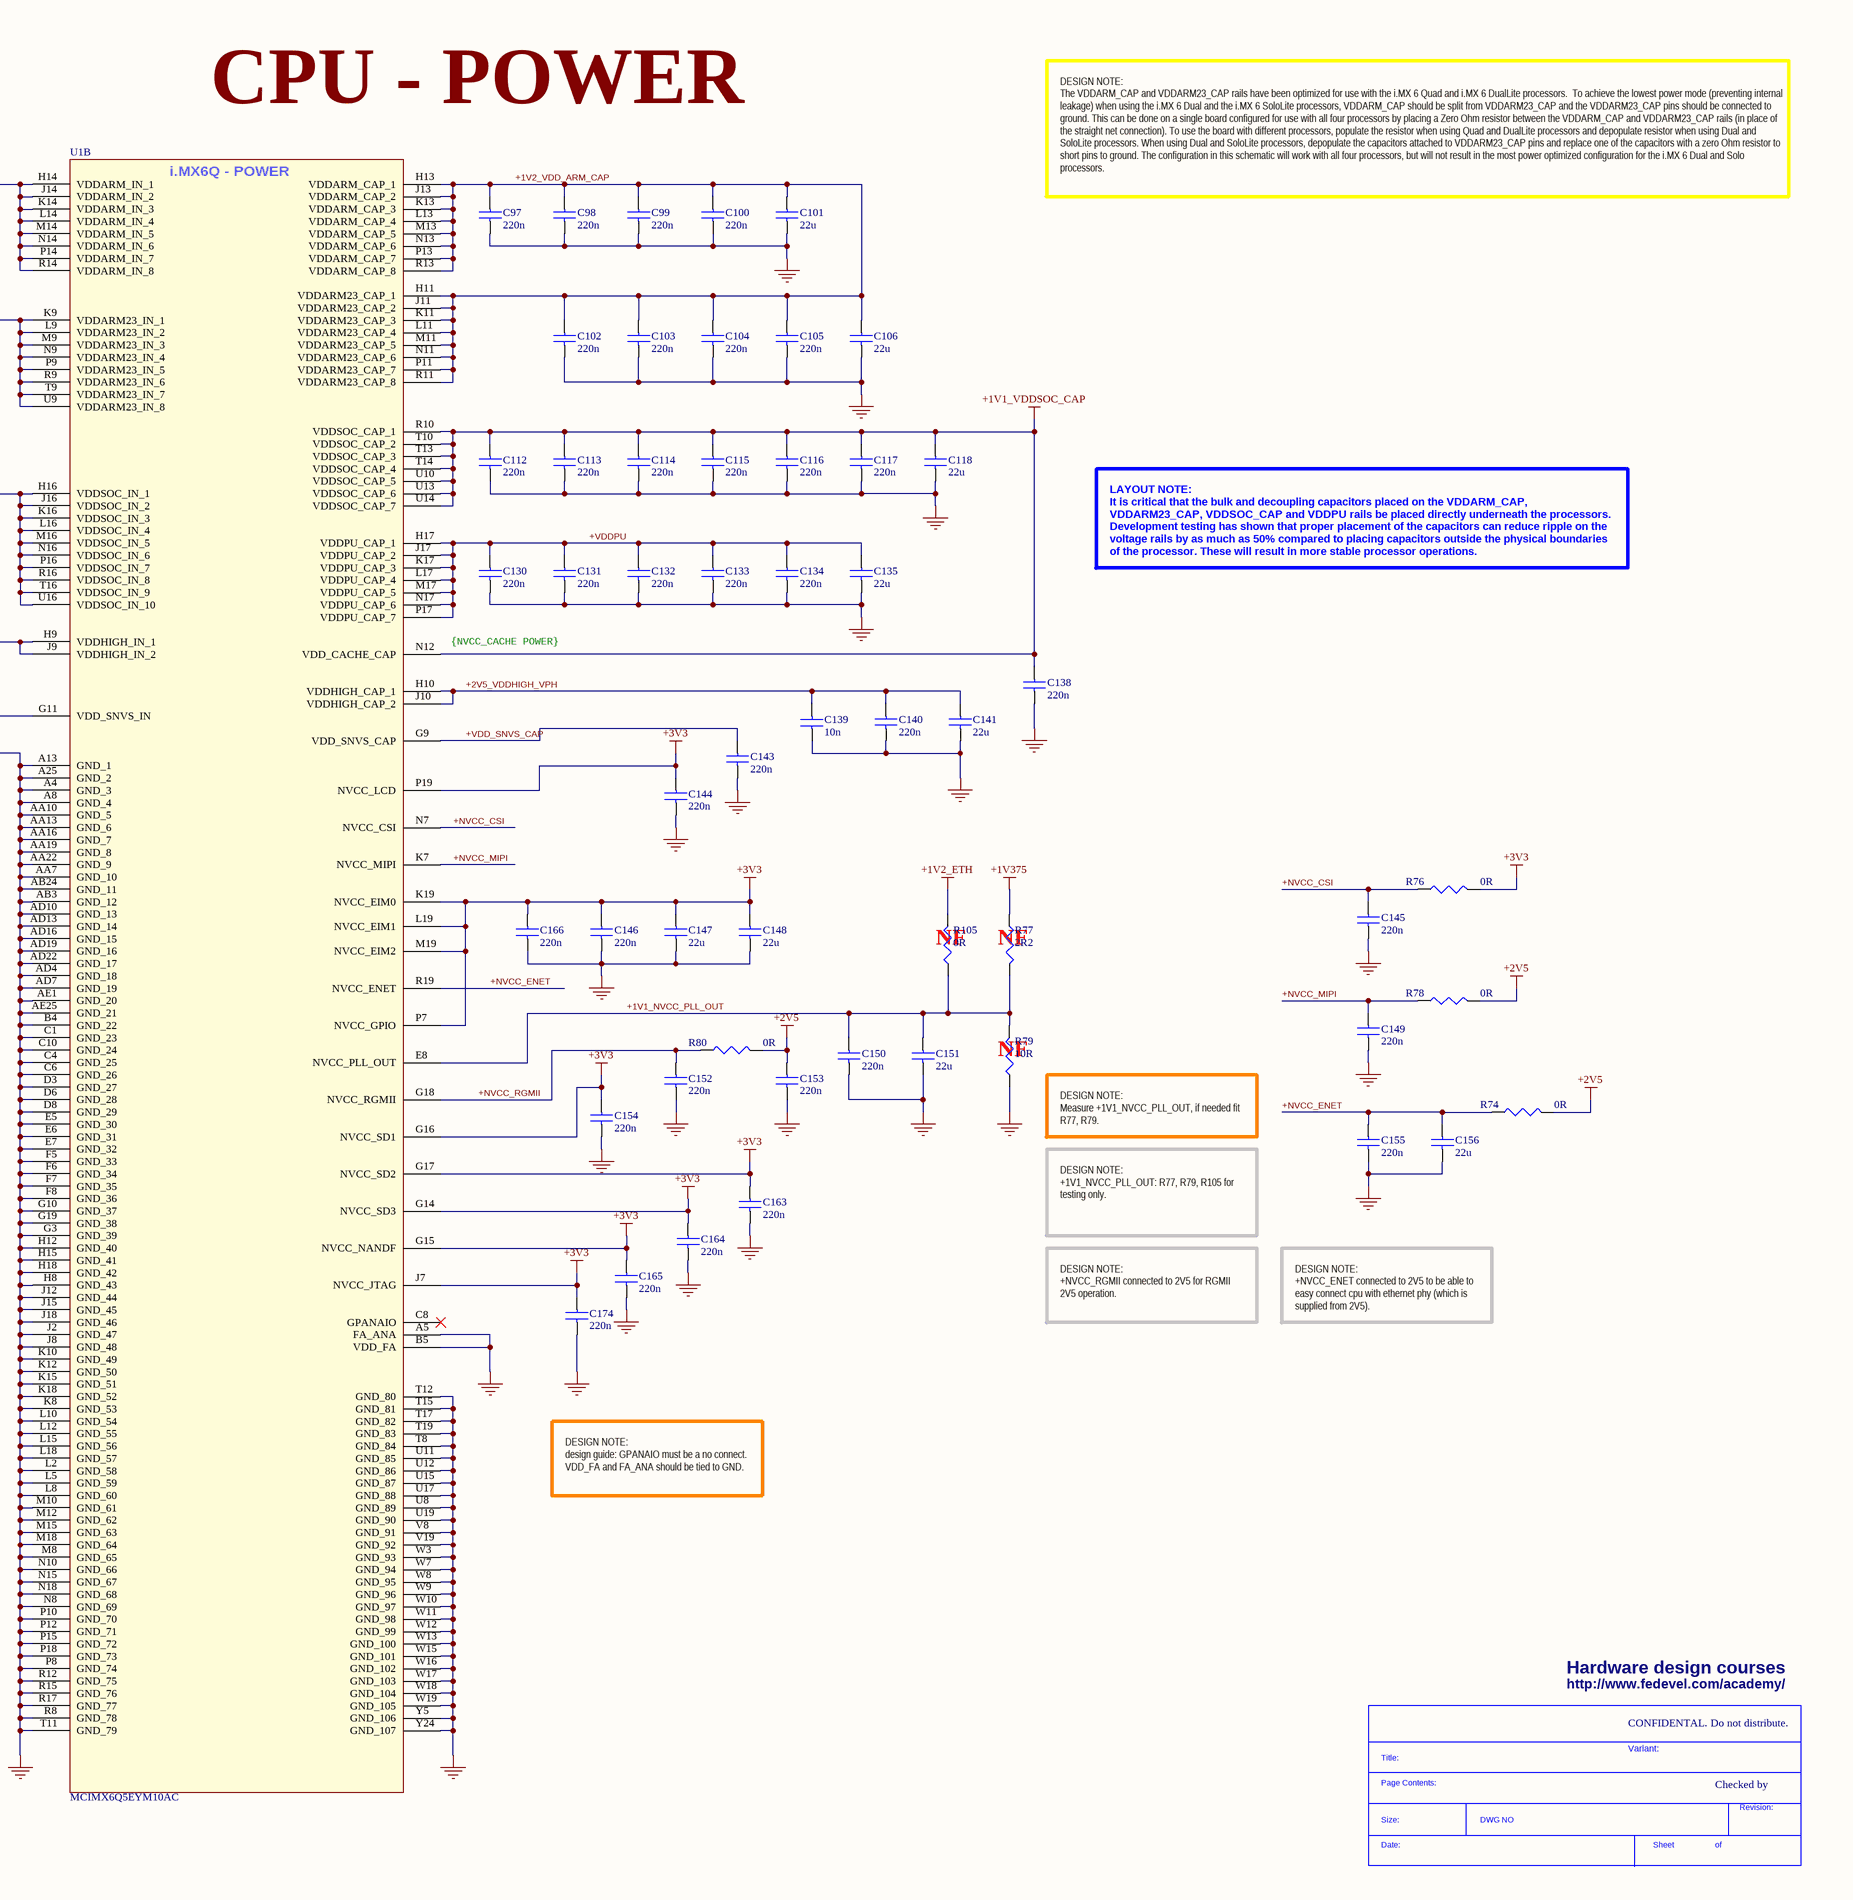
[diagram p5: [11] - CPU - POWER.SchDoc, right]

### Parts
(Parts that share a designator on the sheet are numbered #1, #2 ... from top to bottom, then left to right.)
*#4  SDTitleBlock  (value not drawn)  (graphical)
C90  220n  [C0402]
C91  220n  [C0402]
C92  220n  [C0402]
C93  220n  [C0402]
C94  220n  [C0402]
C95  220n  [C0402]
C96  22u  [C0603]
C97  220n  [C0402]
C98  220n  [C0402]
C99  220n  [C0402]
C100  220n  [C0402]
C101  22u  [C0603]
C102  220n  [C0402]
C103  220n  [C0402]
C104  220n  [C0402]
C105  220n  [C0402]
C106  22u  [C0603]
C107  220n  [C0402]
C108  220n  [C0402]
C109  220n  [C0402]
C110  220n  [C0402]
C111  22u  [C0603]
C112  220n  [C0402]
C113  220n  [C0402]
C114  220n  [C0402]
C115  220n  [C0402]
C116  220n  [C0402]
C117  220n  [C0402]
C118  22u  [C0603]
C119  220n  [C0402]
C120  220n  [C0402]
C121  220n  [C0402]
C122  220n  [C0402]
C123  220n  [C0402]
C124  220n  [C0402]
C125  220n  [C0402]
C126  220n  [C0402]
C127  22u  [C0603]
C128  22u  [C0603]
C129  22u  [C0603]
C130  220n  [C0402]
C131  220n  [C0402]
C132  220n  [C0402]
C133  220n  [C0402]
C134  220n  [C0402]
C135  22u  [C0603]
C136  220n  [C0402]
C137  22u  [C0805]
C138  220n  [C0402]
C139  10n  [C0402]
C140  220n  [C0402]
C141  22u  [C0805]
C142  220n  [C0402]
C143  220n  [C0402]
C144  220n  [C0402]
C145  220n  [C0402]
C146  220n  [C0402]
C147  22u  [C0805]
C148  22u  [C0805]
C149  220n  [C0402]
C150  220n  [C0402]
C151  22u  [C0603]
C152  220n  [C0402]
C153  220n  [C0402]
C154  220n  [C0402]
C155  220n  [C0402]
C156  22u  [C0805]
C157  220n  [C0402]
C158  220n  [C0402]
C159  220n  [C0402]
C160  220n  [C0402]
C161  220n  [C0402]
C162  220n  [C0402]
C163  220n  [C0402]
C164  220n  [C0402]
C165  220n  [C0402]
C166  220n  [C0402]
C167  220n  [C0402]
C168  220n  [C0402]
C169  220n  [C0402]
C170  220n  [C0402]
C171  220n  [C0402]
C172  22u  [C0603]
C173  22u  [C0603]
C174  220n  [C0402]
FB2  220R, 2.5A  [C0603]
R74  0R  [R0402]
R76  0R  [R0402]
R77  2R2  [R0402]
R78  0R  [R0402]
R79  10R  [R0402]
R80  0R  [R0402]
R105  0R  [R0402]
U1  MCIMX6Q5EYM10AC  [PBGA624]  (part B of 15)

### Nets
+1V1_VDDSOC_CAP: C112.1 C113.1 C114.1 C115.1 C116.1 C117.1 C118.1 C138.1 U1.N12(VDD_CACHE_CAP) U1.R10(VDDSOC_CAP_1) U1.T10(VDDSOC_CAP_2) U1.T13(VDDSOC_CAP_3) U1.T14(VDDSOC_CAP_4) U1.U10(VDDSOC_CAP_5) U1.U13(VDDSOC_CAP_6) U1.U14(VDDSOC_CAP_7)
+1V2_ETH: R105.2
+1V5_DDR: C157.1 C158.1 C159.1 C160.1 C161.1 C162.1 C167.1 C168.1 C169.1 C170.1 C171.1 C172.1 C173.1
+1V375: C90.1 C91.1 C92.1 C93.1 C94.1 C95.1 C96.1 C107.1 C108.1 C109.1 C110.1 C111.1 FB2.2 R77.1 U1.H14(VDDARM_IN_1) U1.J14(VDDARM_IN_2) U1.K9(VDDARM23_IN_1) U1.K14(VDDARM_IN_3) U1.L9(VDDARM23_IN_2) U1.L14(VDDARM_IN_4) U1.M9(VDDARM23_IN_3) U1.M14(VDDARM_IN_5) U1.N9(VDDARM23_IN_4) U1.N14(VDDARM_IN_6) U1.P9(VDDARM23_IN_5) U1.P14(VDDARM_IN_7) U1.R9(VDDARM23_IN_6) U1.R14(VDDARM_IN_8) U1.T9(VDDARM23_IN_7) U1.U9(VDDARM23_IN_8)
+2V5: C153.1 R74.2 R78.2 R80.2
+3V0_ALWAYS: C136.1 C137.1 C142.1 U1.G11(VDD_SNVS_IN) U1.H9(VDDHIGH_IN_1) U1.J9(VDDHIGH_IN_2)
+3V3: C144.1 C146.1 C147.1 C148.1 C154.1 C163.1 C164.1 C165.1 C166.1 C174.1 R76.2 U1.G14(NVCC_SD3) U1.G15(NVCC_NANDF) U1.G16(NVCC_SD1) U1.G17(NVCC_SD2) U1.J7(NVCC_JTAG) U1.K19(NVCC_EIM0) U1.L19(NVCC_EIM1) U1.M19(NVCC_EIM2) U1.P7(NVCC_GPIO) U1.P19(NVCC_LCD)
GND: C90.2 C91.2 C92.2 C93.2 C94.2 C95.2 C96.2 C97.2 C98.2 C99.2 C100.2 C101.2 C102.2 C103.2 C104.2 C105.2 C106.2 C107.2 C108.2 C109.2 C110.2 C111.2 C112.2 C113.2 C114.2 C115.2 C116.2 C117.2 C118.2 C119.2 C120.2 C121.2 C122.2 C123.2 C124.2 C125.2 C126.2 C127.2 C128.2 C129.2 C130.2 C131.2 C132.2 C133.2 C134.2 C135.2 C136.2 C137.2 C138.2 C139.1 C140.2 C141.2 C142.2 C143.2 C144.2 C145.2 C146.2 C147.2 C148.2 C149.2 C150.2 C151.2 C152.2 C153.2 C154.2 C155.2 C156.2 C157.2 C158.2 C159.2 C160.2 C161.2 C162.2 C163.2 C164.2 C165.2 C166.2 C167.2 C168.2 C169.2 C170.2 C171.2 C172.2 C173.2 C174.2 R79.1 U1.A4(GND_3) U1.A5(FA_ANA) U1.A8(GND_4) U1.A13(GND_1) U1.A25(GND_2) U1.AA7(GND_10) U1.AA10(GND_5) U1.AA13(GND_6) U1.AA16(GND_7) U1.AA19(GND_8) U1.AA22(GND_9) U1.AB3(GND_12) U1.AB24(GND_11) U1.AD4(GND_18) U1.AD7(GND_19) U1.AD10(GND_13) U1.AD13(GND_14) U1.AD16(GND_15) U1.AD19(GND_16) U1.AD22(GND_17) U1.AE1(GND_20) U1.AE25(GND_21) U1.B4(GND_22) U1.B5(VDD_FA) U1.C1(GND_23) U1.C4(GND_25) U1.C6(GND_26) U1.C10(GND_24) U1.D3(GND_27) U1.D6(GND_28) U1.D8(GND_29) U1.E5(GND_30) U1.E6(GND_31) U1.E7(GND_32) U1.F5(GND_33) U1.F6(GND_34) U1.F7(GND_35) U1.F8(GND_36) U1.G3(GND_39) U1.G10(GND_37) U1.G19(GND_38) U1.H8(GND_43) U1.H12(GND_40) U1.H15(GND_41) U1.H18(GND_42) U1.J2(GND_47) U1.J8(GND_48) U1.J12(GND_44) U1.J15(GND_45) U1.J18(GND_46) U1.K8(GND_53) U1.K10(GND_49) U1.K12(GND_50) U1.K15(GND_51) U1.K18(GND_52) U1.L2(GND_58) U1.L5(GND_59) U1.L8(GND_60) U1.L10(GND_54) U1.L12(GND_55) U1.L15(GND_56) U1.L18(GND_57) U1.M8(GND_65) U1.M10(GND_61) U1.M12(GND_62) U1.M15(GND_63) U1.M18(GND_64) U1.N8(GND_69) U1.N10(GND_66) U1.N15(GND_67) U1.N18(GND_68) U1.P8(GND_74) U1.P10(GND_70) U1.P12(GND_71) U1.P15(GND_72) U1.P18(GND_73) U1.R8(GND_78) U1.R12(GND_75) U1.R15(GND_76) U1.R17(GND_77) U1.T8(GND_84) U1.T11(GND_79) U1.T12(GND_80) U1.T15(GND_81) U1.T17(GND_82) U1.T19(GND_83) U1.U8(GND_89) U1.U11(GND_85) U1.U12(GND_86) U1.U15(GND_87) U1.U17(GND_88) U1.U19(GND_90) U1.V8(GND_91) U1.V19(GND_92) U1.W3(GND_93) U1.W7(GND_94) U1.W8(GND_95) U1.W9(GND_96) U1.W10(GND_97) U1.W11(GND_98) U1.W12(GND_99) U1.W13(GND_100) U1.W15(GND_101) U1.W16(GND_102) U1.W17(GND_103) U1.W18(GND_104) U1.W19(GND_105) U1.Y5(GND_106) U1.Y24(GND_107)
+1V1_NVCC_PLL_OUT: C150.1 C151.1 R77.2 R79.2 R105.1 U1.E8(NVCC_PLL_OUT)
+1V2_VDD_ARM_CAP: C97.1 C98.1 C99.1 C100.1 C101.1 C102.1 C103.1 C104.1 C105.1 C106.1 U1.H11(VDDARM23_CAP_1) U1.H13(VDDARM_CAP_1) U1.J11(VDDARM23_CAP_2) U1.J13(VDDARM_CAP_2) U1.K11(VDDARM23_CAP_3) U1.K13(VDDARM_CAP_3) U1.L11(VDDARM23_CAP_4) U1.L13(VDDARM_CAP_4) U1.M11(VDDARM23_CAP_5) U1.M13(VDDARM_CAP_5) U1.N11(VDDARM23_CAP_6) U1.N13(VDDARM_CAP_6) U1.P11(VDDARM23_CAP_7) U1.P13(VDDARM_CAP_7) U1.R11(VDDARM23_CAP_8) U1.R13(VDDARM_CAP_8)
+1V375_VDDSOC_IN: C119.1 C120.1 C121.1 C122.1 C123.1 C124.1 C125.1 C126.1 C127.1 C128.1 C129.1 FB2.1 U1.H16(VDDSOC_IN_1) U1.J16(VDDSOC_IN_2) U1.K16(VDDSOC_IN_3) U1.L16(VDDSOC_IN_4) U1.M16(VDDSOC_IN_5) U1.N16(VDDSOC_IN_6) U1.P16(VDDSOC_IN_7) U1.R16(VDDSOC_IN_8) U1.T16(VDDSOC_IN_9) U1.U16(VDDSOC_IN_10)
+2V5_VDDHIGH_VPH: C139.2 C140.1 C141.1 U1.H10(VDDHIGH_CAP_1) U1.J10(VDDHIGH_CAP_2)
+NVCC_CSI: C145.1 R76.1 U1.N7(NVCC_CSI)
+NVCC_ENET: C155.1 C156.1 R74.1 U1.R19(NVCC_ENET)
+NVCC_MIPI: C149.1 R78.1 U1.K7(NVCC_MIPI)
+NVCC_RGMII: C152.1 R80.1 U1.G18(NVCC_RGMII)
+VDD_SNVS_CAP: C143.1 U1.G9(VDD_SNVS_CAP)
+VDDPU: C130.1 C131.1 C132.1 C133.1 C134.1 C135.1 U1.H17(VDDPU_CAP_1) U1.J17(VDDPU_CAP_2) U1.K17(VDDPU_CAP_3) U1.L17(VDDPU_CAP_4) U1.M17(VDDPU_CAP_5) U1.N17(VDDPU_CAP_6) U1.P17(VDDPU_CAP_7)

Not connected (* = marked no-connect by the designer): U1 C8(GPANAIO)*

### Notes on the sheet
- CPU - POWER
- 2500mA (max 3920mA)
- DESIGN NOTE:
  Disable LDOs for VDDARM_IN, VDDARM23_IN and VDDSOC_IN.
- DESIGN NOTE:
  For testing purpuse only: Set +1V375 to +1.24V (when LDO VDDARM, VDDARM23 and VDDSOC are disabled) to lower power dissipation.
- DESIGN NOTE:
  The VDDARM_CAP and VDDARM23_CAP rails have been optimized for use with the i.MX 6 Quad and i.MX 6 DualLite processors.  To achieve the lowest power mode (preventing internal leakage) when using the i.MX 6 Dual and the i.MX 6 SoloLite processors, VDDARM_CAP should be split from VDDARM23_CAP and the VDDARM23_CAP pins should be connected to ground. This can be done on a single board configured for use with all four processors by placing a Zero Ohm resistor between the VDDARM_CAP and VDDARM23_CAP rails (in place of the straight net connection). To use the board with different processors, populate the resistor when using Quad and DualLite processors and depopulate resistor when using Dual and SoloLite processors. When using Dual and SoloLite processors, depopulate the capacitors attached to VDDARM23_CAP pins and replace one of the capacitors with a zero Ohm resistor to short pins to ground. The configuration in this schematic will work with all four processors, but will not result in the most power optimized configuration for the i.MX 6 Dual and Solo processors.
- 1750mA (max 1890mA)
- LAYOUT NOTE:
  It is critical that the bulk and decoupling capacitors placed on the VDDARM_CAP, VDDARM23_CAP, VDDSOC_CAP and VDDPU rails be placed directly underneath the processors. Development testing has shown that proper placement of the capacitors can reduce ripple on the voltage rails by as much as 50% compared to placing capacitors outside the physical boundaries of the processor. These will result in more stable processor operations.
- 100mA (max 125mA)
- {NVCC_CACHE POWER}
- (near R105) NF
- (near R77) NF
- (near R79) NF
- MX6 power domains under-BGA decoupling (belongs to CPU pins on page 4)
- DESIGN NOTE:
  Measure +1V1_NVCC_PLL_OUT, if needed fit R77, R79.
- DESIGN NOTE:
  +1V1_NVCC_PLL_OUT: R77, R79, R105 for testing only.
- DESIGN NOTE:
  +NVCC_RGMII connected to 2V5 for RGMII 2V5 operation.
- DESIGN NOTE:
  +NVCC_ENET connected to 2V5 to be able to easy connect cpu with ethernet phy (which is supplied from 2V5).
- DESIGN NOTE:
  design guide: GPANAIO must be a no connect. VDD_FA and FA_ANA should be tied to GND.
- Hardware design courses
- http://www.fedevel.com/academy/
- CONFIDENTAL. Do not distribute.
- Variant:
- Checked by
- (in symbol MCIMX6Q5EYM10AC, part B) i.MX6Q - POWER
- (in symbol SDTitleBlock) Title:; Page Contents:; Revision:; Size:; DWG NO; Date:; Sheet; of

### Library data of the parts
C90-C95 C97-C100 C102-C105 C107-C110 C112-C117 C119-C126 C130-C134 C136 C138 C140 C142-C146 C149 C150 C152-C155 C157-C171 C174 = C1005X5R1E224M: CAP CER .22UF 25V X5R 20% 0402; Manufacturer: TDK Corporation; Capacitance: 0.22µF; Value: 220nF; .Checked PCB: used; Category: Capacitors; Supplier Part Number: 445-5945-1-ND; Manufacturer Part Number: C1005X5R1E224M; Operating Temperature: -55°C ~ 85°C; Package / Case: 0402 (1005 Metric); Price 1k [$]: 0.02600; .Checked SCH: used; Voltage - Rated: 25V; Supplier: Digikey; Supplier 1: Digi-Key; Supplier Part Number 1: 445-5945-1-ND; RoHS: RoHS Compliant; Stock 1: 54593; Pricing 1: 1=0.3, 10=0.2, 100=0.08, 250=0.05752, 500=0.041, 1000=0.03 (USD); Tolerance: ±20%; Temperature Coefficient: X5R; Mounting Type: Surface Mount, MLCC; Applications: General Purpose; Ratings: -; Size / Dimension: 0.039" L x 0.020" W (1.00mm x 0.50mm); Height - Seated (Max): -; Thickness (Max): 0.022" (0.55mm); Lead Spacing: -; Features: -; Packaging: Cut Tape (CT); Lead Style: -; ComponentLink1URL: http://www.tdk.co.jp/tefe02/e412_c.pdf; ComponentLink1Description: http://www.tdk.co.jp/tefe02/e412_c.pdf
C96 C101 C106 C111 C118 C127-C129 C135 C151 C172 C173 = GRM188R60G226MEA0L: CAP CER 22UF 4V 20% X5R 0603; Manufacturer: Murata Electronics North America; Capacitance: 22µF; .Checked PCB: RF, used by MM; .Checked SCH: MM, checked by RF; .Creator: MM; Supplier 1: Digi-Key; Supplier Part Number 1: 490-5526-1-ND; Manufacturer Part Number: GRM188R60G226MEA0L; RoHS: RoHS Compliant; Category: Capacitors; Stock 1: 5760; Pricing 1: 1=0.79, 10=0.663, 50=0.4752, 100=0.4158, 250=0.32672, 500=0.297, 1000=0.2376 (USD); Voltage - Rated: 4V; Tolerance: ±20%; Temperature Coefficient: X5R; Mounting Type: Surface Mount, MLCC; Operating Temperature: -55°C ~ 85°C; Applications: General Purpose; Ratings: -; Package / Case: 0603 (1608 Metric); Size / Dimension: 0.063" L x 0.031" W (1.60mm x 0.80mm); Height - Seated (Max): -; Thickness (Max): 0.035" (0.90mm); Lead Spacing: -; Features: -; Packaging: Cut Tape (CT); Lead Style: -; ComponentLink1URL: http://www.murata.com/products/catalog/pdf/c02e.pdf; ComponentLink1Description: http://www.murata.com/products/catalog/pdf/c02e.pdf
C137 C141 C147 C148 C156 = C2012X5R1C226K: CAP CER 22UF 16V 10% X5R 0805; Manufacturer: TDK Corporation; Capacitance: 22µF; .Checked PCB: RF; Supplier 1: Digi-Key; Supplier Part Number 1: 445-6797-1-ND; Manufacturer Part Number: C2012X5R1C226K; RoHS: RoHS Compliant; Category: Capacitors; Stock 1: 15408; Pricing 1: 1=0.77, 10=0.737, 100=0.3575, 250=0.297, 500=0.2695, 1000=0.2475 (USD); Voltage - Rated: 16V; Tolerance: ±10%; Temperature Coefficient: X5R; Mounting Type: Surface Mount, MLCC; Operating Temperature: -55°C ~ 85°C; Applications: General Purpose; Ratings: -; Package / Case: 0805 (2012 Metric); Size / Dimension: 0.079" L x 0.049" W (2.00mm x 1.25mm); Height - Seated (Max): -; Thickness (Max): 0.057" (1.45mm); Lead Spacing: -; Features: -; Packaging: Cut Tape (CT); Lead Style: -; ComponentLink1URL: http://www.tdk.com/pdf/general_B11.pdf; ComponentLink1Description: http://www.tdk.com/pdf/general_B11.pdf; .Checked SCH: RF
C139 = C1005X7R1C103K: CAP CER 10000PF 16V X7R 10% 0402; Manufacturer: TDK Corporation; Value: 10nF; .Checked PCB: used; Capacitance: 10000pF; Category: Capacitors; Supplier Part Number: 445-1262-1-ND; Manufacturer Part Number: C1005X7R1C103K; Operating Temperature: -55°C ~ 125°C; Package / Case: 0402 (1005 Metric); Price 1k [$]: 0.00416; .Checked SCH: used; Voltage - Rated: 16V; Supplier: Digikey; Supplier 1: Digi-Key; Supplier Part Number 1: 445-1262-1-ND; RoHS: RoHS Compliant; Stock 1: 511497; Pricing 1: 1=0.08, 10=0.05, 100=0.018, 250=0.013, 500=0.0096, 1000=0.0065 (USD); Tolerance: ±10%; Temperature Coefficient: X7R; Mounting Type: Surface Mount, MLCC; Applications: General Purpose; Ratings: -; Size / Dimension: 0.039" L x 0.020" W (1.00mm x 0.50mm); Height - Seated (Max): -; Thickness (Max): 0.022" (0.55mm); Lead Spacing: -; Features: -; Packaging: Cut Tape (CT); Lead Style: -; ComponentLink1URL: http://www.tdk.co.jp/tefe02/e412_c.pdf; ComponentLink1Description: http://www.tdk.co.jp/tefe02/e412_c.pdf
FB2 = BLM18SG221TN1D: FERRITE CHIP 220 OHM 2500MA 0603; Manufacturer: Murata Electronics North America; Impedance @ Frequency: 220 Ohm @ 100MHz; DC Resistance (DCR): 40 mOhm Max; Filter Type: Differential Mode - Single; Number of Lines: 1; .Checked PCB: RF; Supplier 1: Digi-Key; Supplier Part Number 1: 490-5225-1-ND; Manufacturer Part Number: BLM18SG221TN1D; RoHS: RoHS Compliant; Category: Filters; Stock 1: 54640; Pricing 1: 1=0.38, 10=0.282, 50=0.1646, 100=0.1316, 250=0.094, 500=0.06392, 1000=0.0517, 5000=0.04042 (USD); Current Rating: 2.5A; Package / Case: 0603 (1608 Metric); Mounting Type: Surface Mount; Packaging: Cut Tape (CT); Height (Max): 0.037" (0.95mm); Size / Dimension: 0.063" L x 0.031" W (1.60mm x 0.80mm); ComponentLink1URL: http://search.murata.co.jp/Ceramy/image/img/PDF/ENG/L0110S0100BLM18S.pdf; ComponentLink1Description: http://search.murata.co.jp/Ceramy/image/img/PDF/ENG/L0110S0100BLM18S.pdf; .Checked SCH: RF
R74 R76 R78 R80 R105 = RC0402JR-070RL: RES 0.0 OHM 1/16W 0402 SMD; Manufacturer: Yageo; Resistance (Ohms): 0.0; Power (Watts): 0.063W, 1/16W; Tolerance: Jumper; .Checked PCB: used; Category: Resistors; Supplier Part Number: 311-0.0JRCT-ND; Manufacturer Part Number: RC0402JR-070RL; Package / Case: 0402 (1005 Metric); Price 1k [$]: 0.01389; Value: 0R; .Checked SCH: used; Supplier: Digikey; Supplier 1: Digi-Key; Supplier Part Number 1: 311-0.0JRCT-ND; RoHS: RoHS Compliant; Stock 1: 1106330; Pricing 1: 10=0.012, 50=0.009, 100=0.0069, 250=0.00512, 500=0.0038, 1000=0.00253 (USD); Composition: Thick Film; Features: -; Temperature Coefficient: -; Size / Dimension: 0.039" L x 0.020" W (1.00mm x 0.50mm); Height: 0.016" (0.40mm); Number of Terminations: 2; Packaging: Cut Tape (CT); ComponentLink1URL: http://www.yageo.com/documents/recent/PYu-RC0402_51_RoHS_L_6.pdf; ComponentLink1Description: http://www.yageo.com/documents/recent/PYu-RC0402_51_RoHS_L_6.pdf
R77 = CRCW04022R20FKED: RES 2.20 OHM 1/16W 1% 0402 SMD; Manufacturer: Vishay Dale; Resistance (Ohms): 2.2; Power (Watts): 0.063W, 1/16W; Temperature Coefficient: ±100ppm/°C; .Checked PCB: RF; Supplier 1: Digi-Key; Supplier Part Number 1: 541-2.20LLCT-ND; Manufacturer Part Number: CRCW04022R20FKED; RoHS: RoHS Compliant; Category: Resistors; Stock 1: 10205; Pricing 1: 10=0.083, 50=0.0444, 200=0.0255, 1000=0.0174 (USD); Composition: Thick Film; Features: -; Tolerance: ±1%; Package / Case: 0402 (1005 Metric); Size / Dimension: 0.039" L x 0.020" W (1.00mm x 0.50mm); Height: 0.016" (0.40mm); Number of Terminations: 2; Packaging: Cut Tape (CT); ComponentLink1URL: http://www.vishay.com/docs/20035/dcrcwe3.pdf; ComponentLink1Description: http://www.vishay.com/docs/20035/dcrcwe3.pdf; .Checked SCH: RF
R79 = RC0402FR-0710RL: RES 10.0 OHM 1/16W 1% 0402 SMD; Manufacturer: Yageo; Resistance (Ohms): 10; Power (Watts): 0.063W, 1/16W; .Checked PCB: used; Temperature Coefficient: ±200ppm/°C; Category: Resistors; Supplier Part Number: 311-10.0LRCT-ND; Manufacturer Part Number: RC0402FR-0710RL; Package / Case: 0402 (1005 Metric); Price 1k [$]: 0.01421; Tolerance: ±1%; Value: 10R; .Checked SCH: used; Supplier: Digikey; Supplier 1: Digi-Key; Supplier Part Number 1: 311-10.0LRCT-ND; RoHS: RoHS Compliant; Stock 1: 681416; Pricing 1: 10=0.014, 50=0.0104, 100=0.0079, 250=0.00584, 500=0.00432, 1000=0.00288 (USD); Composition: Thick Film; Features: -; Size / Dimension: 0.039" L x 0.020" W (1.00mm x 0.50mm); Height: 0.016" (0.40mm); Number of Terminations: 2; Packaging: Cut Tape (CT); ComponentLink1URL: http://www.yageo.com/documents/recent/PYu-RC0402_51_RoHS_L_6.pdf; ComponentLink1Description: http://www.yageo.com/documents/recent/PYu-RC0402_51_RoHS_L_6.pdf
U1 = MCIMX6Q5EYM10AC: as U1 on sheet [09] - CPU - UART, AUDIO; Supplier 1: Digi-Key; Manufacturer Part Number: MCIMX6Q5EYM10AC; RoHS: RoHS Compliant; Category: Integrated Circuits (ICs); Stock 1: 0; Pricing 1: 1=54.98, 10=51.922, 25=48.868, 100=30.5424 (USD); Program Memory Size: -; EEPROM Size: -; Data Converters: -; Operating Temperature: -20°C ~ 105°C; Package / Case: 624-FBGA, FCBGA; Packaging: Tray; ComponentLink1URL: http://cache.freescale.com/files/32bit/doc/data_sheet/IMX6DQCEC.pdf; ComponentLink1Description: http://cache.freescale.com/files/32bit/doc/data_sheet/IMX6DQCEC.pdf; Supplier Part Number 1: MCIMX6Q5EYM10AC-ND; .Checked SCH: MM

## Sheet [12] - CPU - UNUSED.SchDoc
size A2; DocumentNumber: 12; SheetNumber: 12; SheetTotal: 20
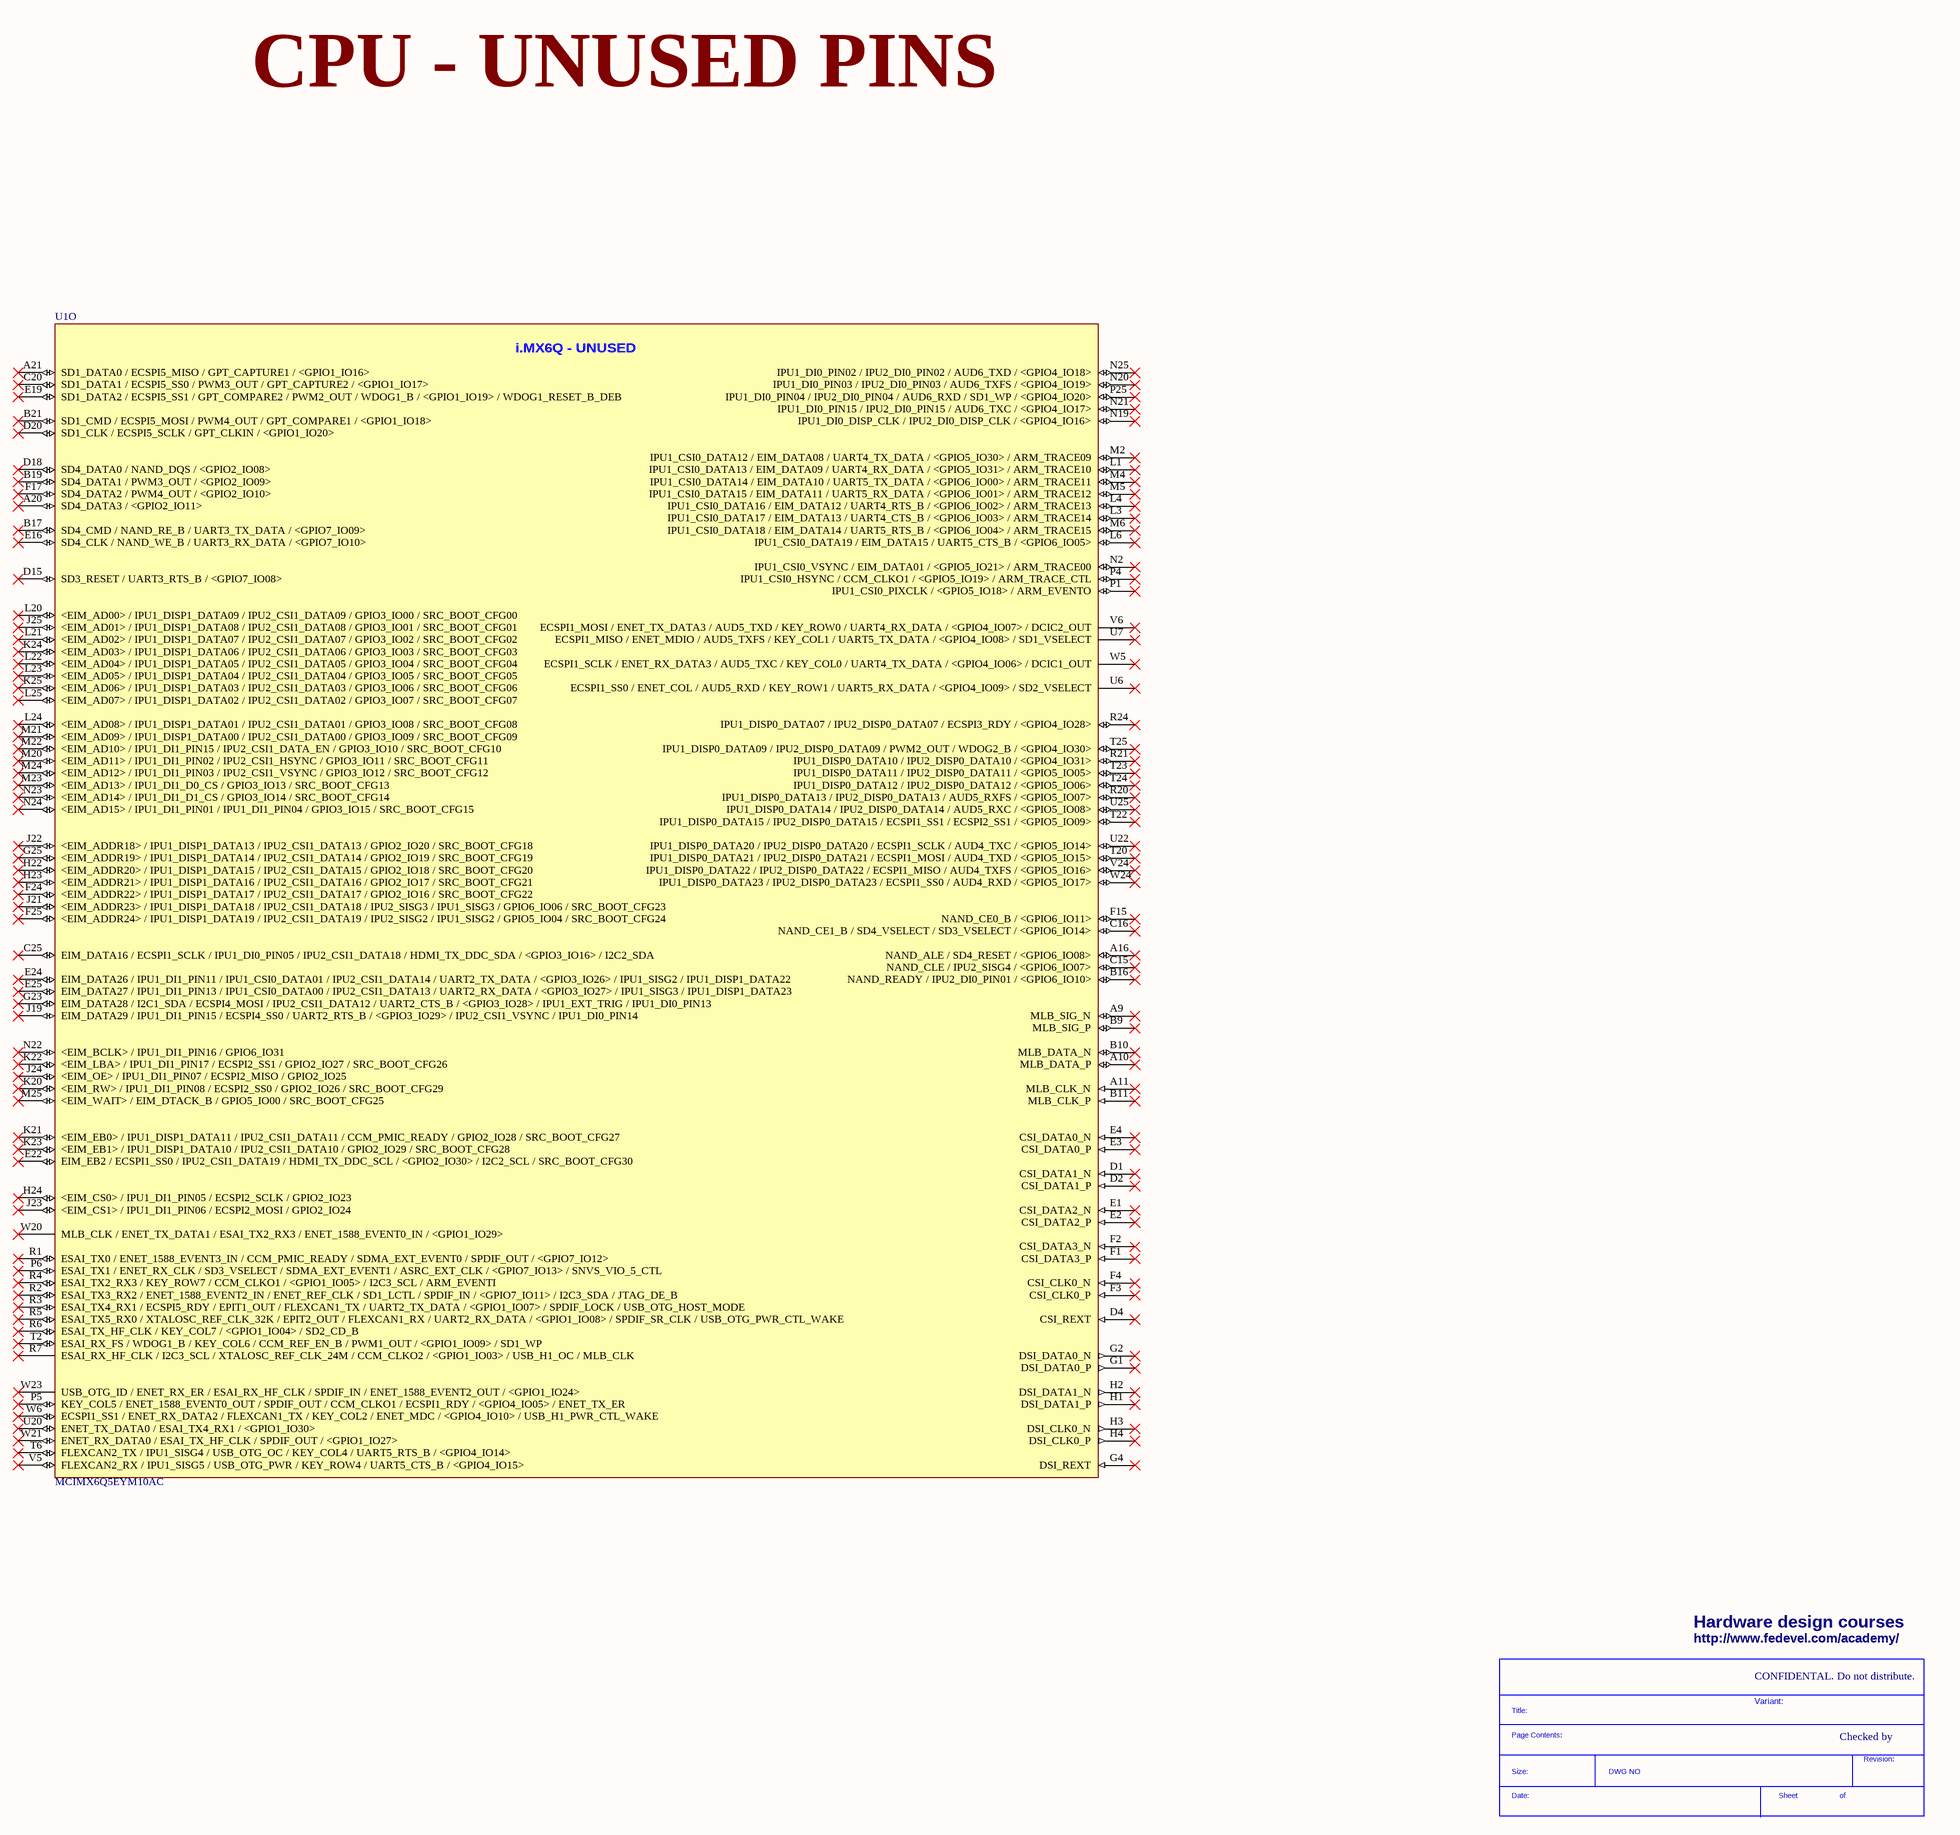
[diagram p6: [12] - CPU - UNUSED.SchDoc]

### Parts
(Parts that share a designator on the sheet are numbered #1, #2 ... from top to bottom, then left to right.)
*#5  SDTitleBlock  (value not drawn)  (graphical)
U1  MCIMX6Q5EYM10AC  [PBGA624]  (part O of 15)

### Nets

Not connected (* = marked no-connect by the designer): U1 A9(MLB_SIG_N)* A10(MLB_DATA_P)* A11(MLB_CLK_N)* A16(NAND_ALE_/_SD4_RESET_/_<GPIO6_IO08>)* A20(SD4_DATA3_/_<GPIO2_IO11>)* A21(SD1_DATA0_/_ECSPI5_MISO_/_GPT_CAPTURE1_/_<GPIO1_IO16>)* B9(MLB_SIG_P)* B10(MLB_DATA_N)* B11(MLB_CLK_P)* B16(NAND_READY_/_IPU2_DI0_PIN01_/_<GPIO6_IO10>)* B17(SD4_CMD_/_NAND_RE_B_/_UART3_TX_DATA_/_<GPIO7_IO09>)* B19(SD4_DATA1_/_PWM3_OUT_/_<GPIO2_IO09>)* B21(SD1_CMD_/_ECSPI5_MOSI_/_PWM4_OUT_/_GPT_COMPARE1_/_<GPIO1_IO18>)* C15(NAND_CLE_/_IPU2_SISG4_/_<GPIO6_IO07>)* C16(NAND_CE1_B_/_SD4_VSELECT_/_SD3_VSELECT_/_<GPIO6_IO14>)* C20(SD1_DATA1_/_ECSPI5_SS0_/_PWM3_OUT_/_GPT_CAPTURE2_/_<GPIO1_IO17>)* C25(EIM_DATA16_/_ECSPI1_SCLK_/_IPU1_DI0_PIN05_/_IPU2_CSI1_DATA18_/_HDMI_TX_DDC_SDA_/_<GPIO3_IO16>_/_I2C2_SDA)* D1(CSI_DATA1_N)* D2(CSI_DATA1_P)* D4(CSI_REXT)* D15(SD3_RESET_/_UART3_RTS_B_/_<GPIO7_IO08>)* D18(SD4_DATA0_/_NAND_DQS_/_<GPIO2_IO08>)* D20(SD1_CLK_/_ECSPI5_SCLK_/_GPT_CLKIN_/_<GPIO1_IO20>)* E1(CSI_DATA2_N)* E2(CSI_DATA2_P)* E3(CSI_DATA0_P)* E4(CSI_DATA0_N)* E16(SD4_CLK_/_NAND_WE_B_/_UART3_RX_DATA_/_<GPIO7_IO10>)* E19(SD1_DATA2_/_ECSPI5_SS1_/_GPT_COMPARE2_/_PWM2_OUT_/_WDOG1_B_/_<GPIO1_IO19>_/_WDOG1_RESET_B_DEB)* E22(EIM_EB2_/_ECSPI1_SS0_/_IPU2_CSI1_DATA19_/_HDMI_TX_DDC_SCL_/_<GPIO2_IO30>_/_I2C2_SCL_/_SRC_BOOT_CFG30)* E24(EIM_DATA26_/_IPU1_DI1_PIN11_/_IPU1_CSI0_DATA01_/_IPU2_CSI1_DATA14_/_UART2_TX_DATA_/_<GPIO3_IO26>_/_IPU1_SISG2_/_IPU1_DISP1_DATA22)* E25(EIM_DATA27_/_IPU1_DI1_PIN13_/_IPU1_CSI0_DATA00_/_IPU2_CSI1_DATA13_/_UART2_RX_DATA_/_<GPIO3_IO27>_/_IPU1_SISG3_/_IPU1_DISP1_DATA23)* F1(CSI_DATA3_P)* F2(CSI_DATA3_N)* F3(CSI_CLK0_P)* F4(CSI_CLK0_N)* F15(NAND_CE0_B_/_<GPIO6_IO11>)* F17(SD4_DATA2_/_PWM4_OUT_/_<GPIO2_IO10>)* F24(<EIM_ADDR22>_/_IPU1_DISP1_DATA17_/_IPU2_CSI1_DATA17_/_GPIO2_IO16_/_SRC_BOOT_CFG22)* F25(<EIM_ADDR24>_/_IPU1_DISP1_DATA19_/_IPU2_CSI1_DATA19_/_IPU2_SISG2_/_IPU1_SISG2_/_GPIO5_IO04_/_SRC_BOOT_CFG24)* G1(DSI_DATA0_P)* G2(DSI_DATA0_N)* G4(DSI_REXT)* G23(EIM_DATA28_/_I2C1_SDA_/_ECSPI4_MOSI_/_IPU2_CSI1_DATA12_/_UART2_CTS_B_/_<GPIO3_IO28>_/_IPU1_EXT_TRIG_/_IPU1_DI0_PIN13)* G25(<EIM_ADDR19>_/_IPU1_DISP1_DATA14_/_IPU2_CSI1_DATA14_/_GPIO2_IO19_/_SRC_BOOT_CFG19)* H1(DSI_DATA1_P)* H2(DSI_DATA1_N)* H3(DSI_CLK0_N)* H4(DSI_CLK0_P)* H22(<EIM_ADDR20>_/_IPU1_DISP1_DATA15_/_IPU2_CSI1_DATA15_/_GPIO2_IO18_/_SRC_BOOT_CFG20)* H23(<EIM_ADDR21>_/_IPU1_DISP1_DATA16_/_IPU2_CSI1_DATA16_/_GPIO2_IO17_/_SRC_BOOT_CFG21)* H24(<EIM_CS0>_/_IPU1_DI1_PIN05_/_ECSPI2_SCLK_/_GPIO2_IO23)* J19(EIM_DATA29_/_IPU1_DI1_PIN15_/_ECSPI4_SS0_/_UART2_RTS_B_/_<GPIO3_IO29>_/_IPU2_CSI1_VSYNC_/_IPU1_DI0_PIN14)* J21(<EIM_ADDR23>_/_IPU1_DISP1_DATA18_/_IPU2_CSI1_DATA18_/_IPU2_SISG3_/_IPU1_SISG3_/_GPIO6_IO06_/_SRC_BOOT_CFG23)* J22(<EIM_ADDR18>_/_IPU1_DISP1_DATA13_/_IPU2_CSI1_DATA13_/_GPIO2_IO20_/_SRC_BOOT_CFG18)* J23(<EIM_CS1>_/_IPU1_DI1_PIN06_/_ECSPI2_MOSI_/_GPIO2_IO24)* J24(<EIM_OE>_/_IPU1_DI1_PIN07_/_ECSPI2_MISO_/_GPIO2_IO25)* J25(<EIM_AD01>_/_IPU1_DISP1_DATA08_/_IPU2_CSI1_DATA08_/_GPIO3_IO01_/_SRC_BOOT_CFG01)* K20(<EIM_RW>_/_IPU1_DI1_PIN08_/_ECSPI2_SS0_/_GPIO2_IO26_/_SRC_BOOT_CFG29)* K21(<EIM_EB0>_/_IPU1_DISP1_DATA11_/_IPU2_CSI1_DATA11_/_CCM_PMIC_READY_/_GPIO2_IO28_/_SRC_BOOT_CFG27)* K22(<EIM_LBA>_/_IPU1_DI1_PIN17_/_ECSPI2_SS1_/_GPIO2_IO27_/_SRC_BOOT_CFG26)* K23(<EIM_EB1>_/_IPU1_DISP1_DATA10_/_IPU2_CSI1_DATA10_/_GPIO2_IO29_/_SRC_BOOT_CFG28)* K24(<EIM_AD03>_/_IPU1_DISP1_DATA06_/_IPU2_CSI1_DATA06_/_GPIO3_IO03_/_SRC_BOOT_CFG03)* K25(<EIM_AD06>_/_IPU1_DISP1_DATA03_/_IPU2_CSI1_DATA03_/_GPIO3_IO06_/_SRC_BOOT_CFG06)* L1(IPU1_CSI0_DATA13_/_EIM_DATA09_/_UART4_RX_DATA_/_<GPIO5_IO31>_/_ARM_TRACE10)* L3(IPU1_CSI0_DATA17_/_EIM_DATA13_/_UART4_CTS_B_/_<GPIO6_IO03>_/_ARM_TRACE14)* L4(IPU1_CSI0_DATA16_/_EIM_DATA12_/_UART4_RTS_B_/_<GPIO6_IO02>_/_ARM_TRACE13)* L6(IPU1_CSI0_DATA19_/_EIM_DATA15_/_UART5_CTS_B_/_<GPIO6_IO05>)* L20(<EIM_AD00>_/_IPU1_DISP1_DATA09_/_IPU2_CSI1_DATA09_/_GPIO3_IO00_/_SRC_BOOT_CFG00)* L21(<EIM_AD02>_/_IPU1_DISP1_DATA07_/_IPU2_CSI1_DATA07_/_GPIO3_IO02_/_SRC_BOOT_CFG02)* L22(<EIM_AD04>_/_IPU1_DISP1_DATA05_/_IPU2_CSI1_DATA05_/_GPIO3_IO04_/_SRC_BOOT_CFG04)* L23(<EIM_AD05>_/_IPU1_DISP1_DATA04_/_IPU2_CSI1_DATA04_/_GPIO3_IO05_/_SRC_BOOT_CFG05)* L24(<EIM_AD08>_/_IPU1_DISP1_DATA01_/_IPU2_CSI1_DATA01_/_GPIO3_IO08_/_SRC_BOOT_CFG08)* L25(<EIM_AD07>_/_IPU1_DISP1_DATA02_/_IPU2_CSI1_DATA02_/_GPIO3_IO07_/_SRC_BOOT_CFG07)* M2(IPU1_CSI0_DATA12_/_EIM_DATA08_/_UART4_TX_DATA_/_<GPIO5_IO30>_/_ARM_TRACE09)* M4(IPU1_CSI0_DATA14_/_EIM_DATA10_/_UART5_TX_DATA_/_<GPIO6_IO00>_/_ARM_TRACE11)* M5(IPU1_CSI0_DATA15_/_EIM_DATA11_/_UART5_RX_DATA_/_<GPIO6_IO01>_/_ARM_TRACE12)* M6(IPU1_CSI0_DATA18_/_EIM_DATA14_/_UART5_RTS_B_/_<GPIO6_IO04>_/_ARM_TRACE15)* M20(<EIM_AD11>_/_IPU1_DI1_PIN02_/_IPU2_CSI1_HSYNC_/_GPIO3_IO11_/_SRC_BOOT_CFG11)* M21(<EIM_AD09>_/_IPU1_DISP1_DATA00_/_IPU2_CSI1_DATA00_/_GPIO3_IO09_/_SRC_BOOT_CFG09)* M22(<EIM_AD10>_/_IPU1_DI1_PIN15_/_IPU2_CSI1_DATA_EN_/_GPIO3_IO10_/_SRC_BOOT_CFG10)* M23(<EIM_AD13>_/_IPU1_DI1_D0_CS_/_GPIO3_IO13_/_SRC_BOOT_CFG13)* M24(<EIM_AD12>_/_IPU1_DI1_PIN03_/_IPU2_CSI1_VSYNC_/_GPIO3_IO12_/_SRC_BOOT_CFG12)* M25(<EIM_WAIT>_/_EIM_DTACK_B_/_GPIO5_IO00_/_SRC_BOOT_CFG25)* N2(IPU1_CSI0_VSYNC_/_EIM_DATA01_/_<GPIO5_IO21>_/_ARM_TRACE00)* N19(IPU1_DI0_DISP_CLK_/_IPU2_DI0_DISP_CLK_/_<GPIO4_IO16>)* N20(IPU1_DI0_PIN03_/_IPU2_DI0_PIN03_/_AUD6_TXFS_/_<GPIO4_IO19>)* N21(IPU1_DI0_PIN15_/_IPU2_DI0_PIN15_/_AUD6_TXC_/_<GPIO4_IO17>)* N22(<EIM_BCLK>_/_IPU1_DI1_PIN16_/_GPIO6_IO31)* N23(<EIM_AD14>_/_IPU1_DI1_D1_CS_/_GPIO3_IO14_/_SRC_BOOT_CFG14)* N24(<EIM_AD15>_/_IPU1_DI1_PIN01_/_IPU1_DI1_PIN04_/_GPIO3_IO15_/_SRC_BOOT_CFG15)* N25(IPU1_DI0_PIN02_/_IPU2_DI0_PIN02_/_AUD6_TXD_/_<GPIO4_IO18>)* P1(IPU1_CSI0_PIXCLK_/_<GPIO5_IO18>_/_ARM_EVENTO)* P4(IPU1_CSI0_HSYNC_/_CCM_CLKO1_/_<GPIO5_IO19>_/_ARM_TRACE_CTL)* P5(KEY_COL5_/_ENET_1588_EVENT0_OUT_/_SPDIF_OUT_/_CCM_CLKO1_/_ECSPI1_RDY_/_<GPIO4_IO05>_/_ENET_TX_ER)* P6(ESAI_TX1_/_ENET_RX_CLK_/_SD3_VSELECT_/_SDMA_EXT_EVENT1_/_ASRC_EXT_CLK_/_<GPIO7_IO13>_/_SNVS_VIO_5_CTL)* P25(IPU1_DI0_PIN04_/_IPU2_DI0_PIN04_/_AUD6_RXD_/_SD1_WP_/_<GPIO4_IO20>)* R1(ESAI_TX0_/_ENET_1588_EVENT3_IN_/_CCM_PMIC_READY_/_SDMA_EXT_EVENT0_/_SPDIF_OUT_/_<GPIO7_IO12>)* R2(ESAI_TX3_RX2_/_ENET_1588_EVENT2_IN_/_ENET_REF_CLK_/_SD1_LCTL_/_SPDIF_IN_/_<GPIO7_IO11>_/_I2C3_SDA_/_JTAG_DE_B)* R3(ESAI_TX4_RX1_/_ECSPI5_RDY_/_EPIT1_OUT_/_FLEXCAN1_TX_/_UART2_TX_DATA_/_<GPIO1_IO07>_/_SPDIF_LOCK_/_USB_OTG_HOST_MODE)* R4(ESAI_TX2_RX3_/_KEY_ROW7_/_CCM_CLKO1_/_<GPIO1_IO05>_/_I2C3_SCL_/_ARM_EVENTI)* R5(ESAI_TX5_RX0_/_XTALOSC_REF_CLK_32K_/_EPIT2_OUT_/_FLEXCAN1_RX_/_UART2_RX_DATA_/_<GPIO1_IO08>_/_SPDIF_SR_CLK_/_USB_OTG_PWR_CTL_WAKE)* R6(ESAI_TX_HF_CLK_/_KEY_COL7_/_<GPIO1_IO04>_/_SD2_CD_B)* R7(ESAI_RX_HF_CLK_/_I2C3_SCL_/_XTALOSC_REF_CLK_24M_/_CCM_CLKO2_/_<GPIO1_IO03>_/_USB_H1_OC_/_MLB_CLK)* R20(IPU1_DISP0_DATA13_/_IPU2_DISP0_DATA13_/_AUD5_RXFS_/_<GPIO5_IO07>)* R21(IPU1_DISP0_DATA10_/_IPU2_DISP0_DATA10_/_<GPIO4_IO31>)* R24(IPU1_DISP0_DATA07_/_IPU2_DISP0_DATA07_/_ECSPI3_RDY_/_<GPIO4_IO28>)* T2(ESAI_RX_FS_/_WDOG1_B_/_KEY_COL6_/_CCM_REF_EN_B_/_PWM1_OUT_/_<GPIO1_IO09>_/_SD1_WP)* T6(FLEXCAN2_TX_/_IPU1_SISG4_/_USB_OTG_OC_/_KEY_COL4_/_UART5_RTS_B_/_<GPIO4_IO14>)* T20(IPU1_DISP0_DATA21_/_IPU2_DISP0_DATA21_/_ECSPI1_MOSI_/_AUD4_TXD_/_<GPIO5_IO15>)* T22(IPU1_DISP0_DATA15_/_IPU2_DISP0_DATA15_/_ECSPI1_SS1_/_ECSPI2_SS1_/_<GPIO5_IO09>)* T23(IPU1_DISP0_DATA11_/_IPU2_DISP0_DATA11_/_<GPIO5_IO05>)* T24(IPU1_DISP0_DATA12_/_IPU2_DISP0_DATA12_/_<GPIO5_IO06>)* T25(IPU1_DISP0_DATA09_/_IPU2_DISP0_DATA09_/_PWM2_OUT_/_WDOG2_B_/_<GPIO4_IO30>)* U6(ECSPI1_SS0_/_ENET_COL_/_AUD5_RXD_/_KEY_ROW1_/_UART5_RX_DATA_/_<GPIO4_IO09>_/_SD2_VSELECT)* U7(ECSPI1_MISO_/_ENET_MDIO_/_AUD5_TXFS_/_KEY_COL1_/_UART5_TX_DATA_/_<GPIO4_IO08>_/_SD1_VSELECT)* U20(ENET_TX_DATA0_/_ESAI_TX4_RX1_/_<GPIO1_IO30>)* U22(IPU1_DISP0_DATA20_/_IPU2_DISP0_DATA20_/_ECSPI1_SCLK_/_AUD4_TXC_/_<GPIO5_IO14>)* U25(IPU1_DISP0_DATA14_/_IPU2_DISP0_DATA14_/_AUD5_RXC_/_<GPIO5_IO08>)* V5(FLEXCAN2_RX_/_IPU1_SISG5_/_USB_OTG_PWR_/_KEY_ROW4_/_UART5_CTS_B_/_<GPIO4_IO15>)* V6(ECSPI1_MOSI_/_ENET_TX_DATA3_/_AUD5_TXD_/_KEY_ROW0_/_UART4_RX_DATA_/_<GPIO4_IO07>_/_DCIC2_OUT)* V24(IPU1_DISP0_DATA22_/_IPU2_DISP0_DATA22_/_ECSPI1_MISO_/_AUD4_TXFS_/_<GPIO5_IO16>)* W5(ECSPI1_SCLK_/_ENET_RX_DATA3_/_AUD5_TXC_/_KEY_COL0_/_UART4_TX_DATA_/_<GPIO4_IO06>_/_DCIC1_OUT)* W6(ECSPI1_SS1_/_ENET_RX_DATA2_/_FLEXCAN1_TX_/_KEY_COL2_/_ENET_MDC_/_<GPIO4_IO10>_/_USB_H1_PWR_CTL_WAKE)* W20(MLB_CLK_/_ENET_TX_DATA1_/_ESAI_TX2_RX3_/_ENET_1588_EVENT0_IN_/_<GPIO1_IO29>)* W21(ENET_RX_DATA0_/_ESAI_TX_HF_CLK_/_SPDIF_OUT_/_<GPIO1_IO27>)* W23(USB_OTG_ID_/_ENET_RX_ER_/_ESAI_RX_HF_CLK_/_SPDIF_IN_/_ENET_1588_EVENT2_OUT_/_<GPIO1_IO24>)* W24(IPU1_DISP0_DATA23_/_IPU2_DISP0_DATA23_/_ECSPI1_SS0_/_AUD4_RXD_/_<GPIO5_IO17>)*

### Notes on the sheet
- CPU - UNUSED PINS
- Hardware design courses
- http://www.fedevel.com/academy/
- CONFIDENTAL. Do not distribute.
- Variant:
- Checked by
- (in symbol MCIMX6Q5EYM10AC, part O) i.MX6Q - UNUSED
- (in symbol SDTitleBlock) Title:; Page Contents:; Revision:; Size:; DWG NO; Date:; Sheet; of

### Library data of the parts
U1 = MCIMX6Q5EYM10AC: as U1 on sheet [09] - CPU - UART, AUDIO; Supplier 1: Digi-Key; Manufacturer Part Number: MCIMX6Q5EYM10AC; RoHS: RoHS Compliant; Category: Integrated Circuits (ICs); Stock 1: 0; Pricing 1: 1=54.98, 10=51.922, 25=48.868, 100=30.5424 (USD); Program Memory Size: -; EEPROM Size: -; Data Converters: -; Operating Temperature: -20°C ~ 105°C; Package / Case: 624-FBGA, FCBGA; Packaging: Tray; ComponentLink1URL: http://cache.freescale.com/files/32bit/doc/data_sheet/IMX6DQCEC.pdf; ComponentLink1Description: http://cache.freescale.com/files/32bit/doc/data_sheet/IMX6DQCEC.pdf; Supplier Part Number 1: MCIMX6Q5EYM10AC-ND; .Checked SCH: MM